# EAGLE schematic hoektronics-cnc-controller (EAGLE 5.12)

## Sheet 1 of 9
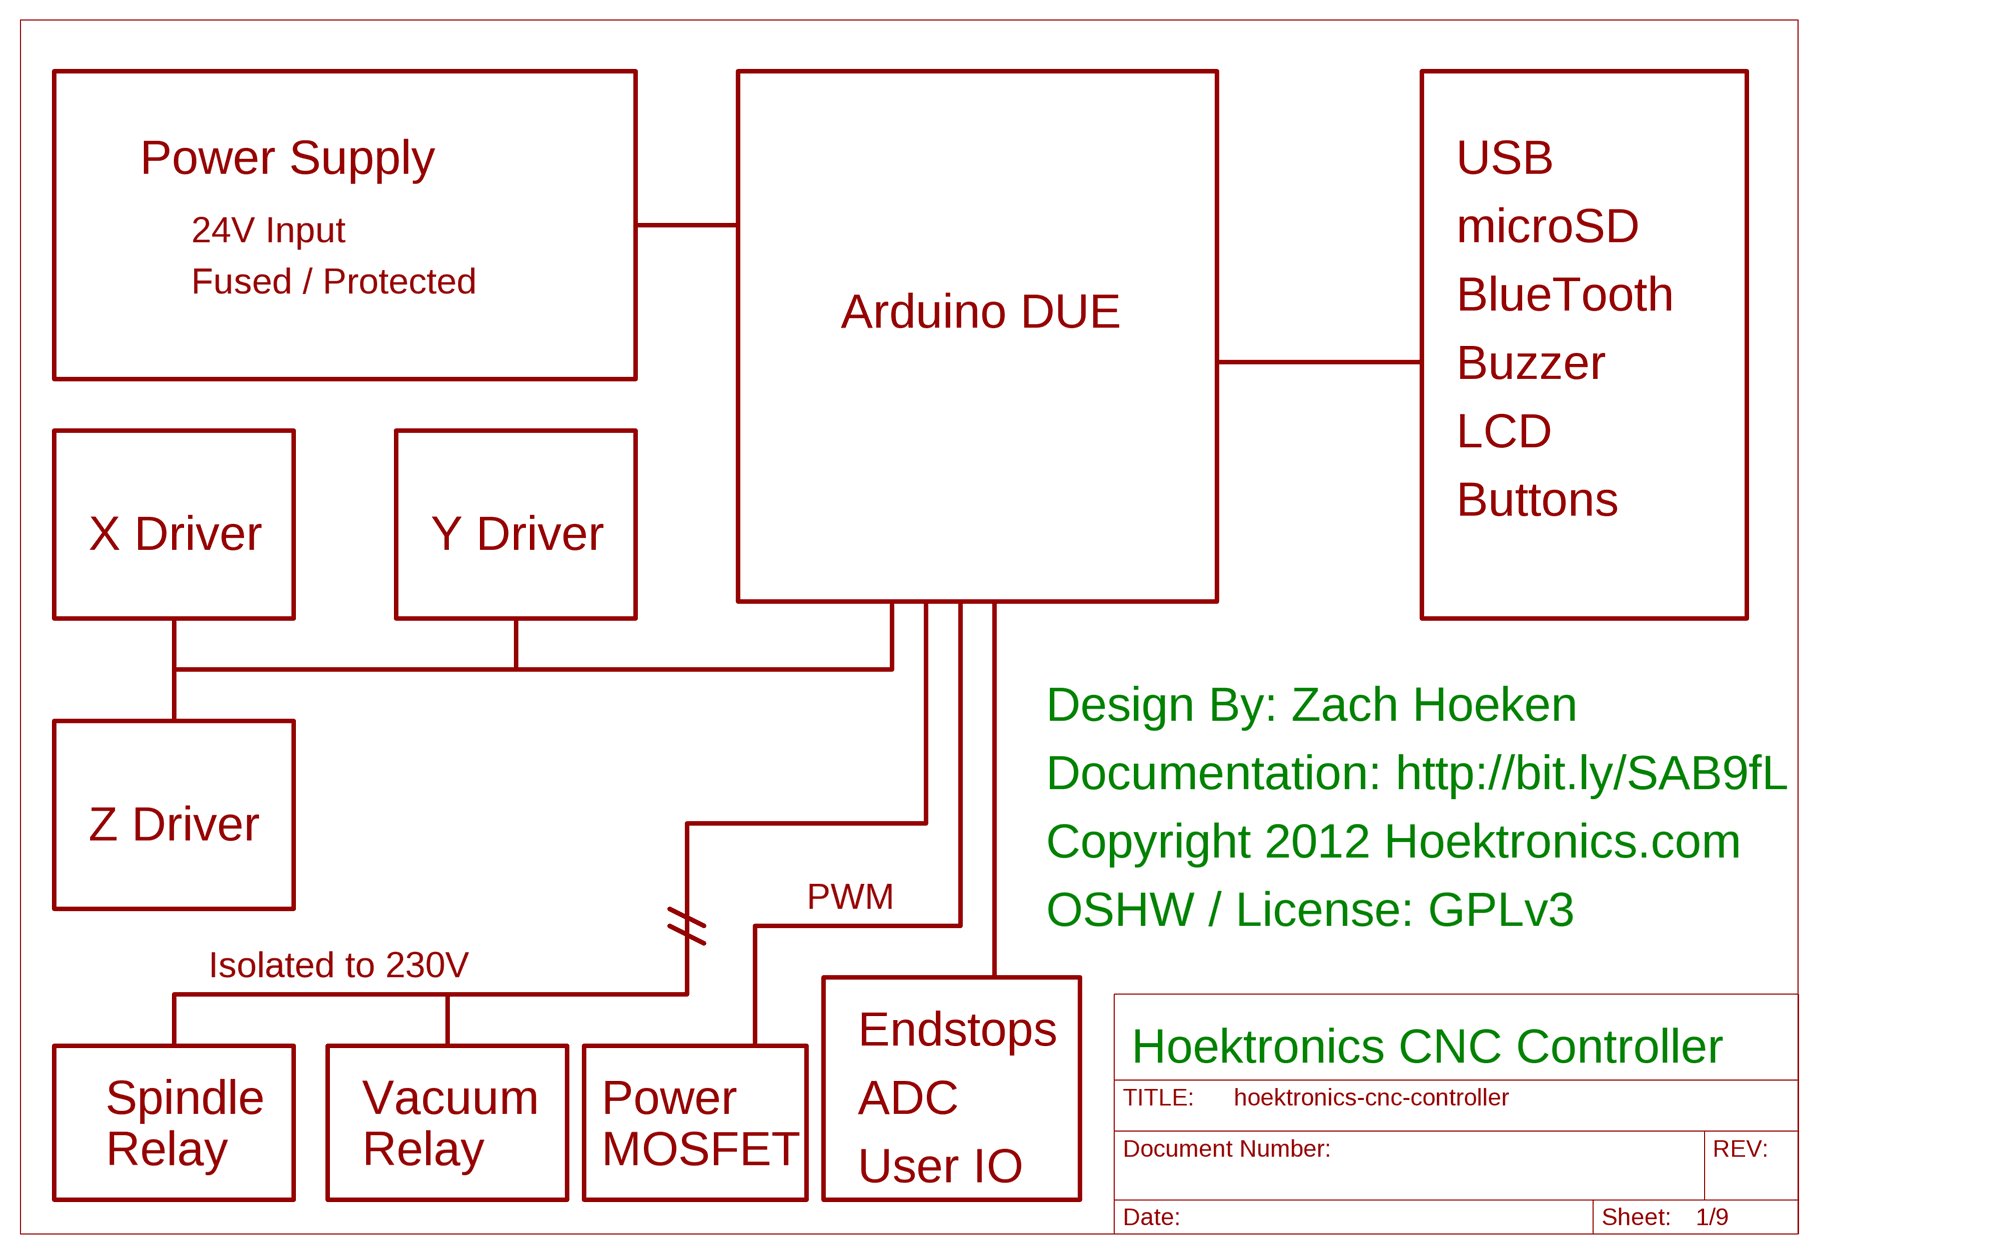
[diagram p0: schematic, sheet 1]

### Notes on the sheet
- Power Supply | USB
- 24V Input | microSD
- Fused / Protected
- BlueTooth
- Arduino DUE
- Buzzer
- LCD
- Buttons
- X Driver | Y Driver
- Design By: Zach Hoeken
- Documentation: http://bit.ly/SAB9fL
- Z Driver
- Copyright 2012 Hoektronics.com
- PWM
- OSHW / License: GPLv3
- Isolated to 230V
- Endstops
- Hoektronics CNC Controller
- Spindle | Vacuum | Power | ADC
- Relay | Relay | MOSFET
- User IO

## Sheet 2 of 9
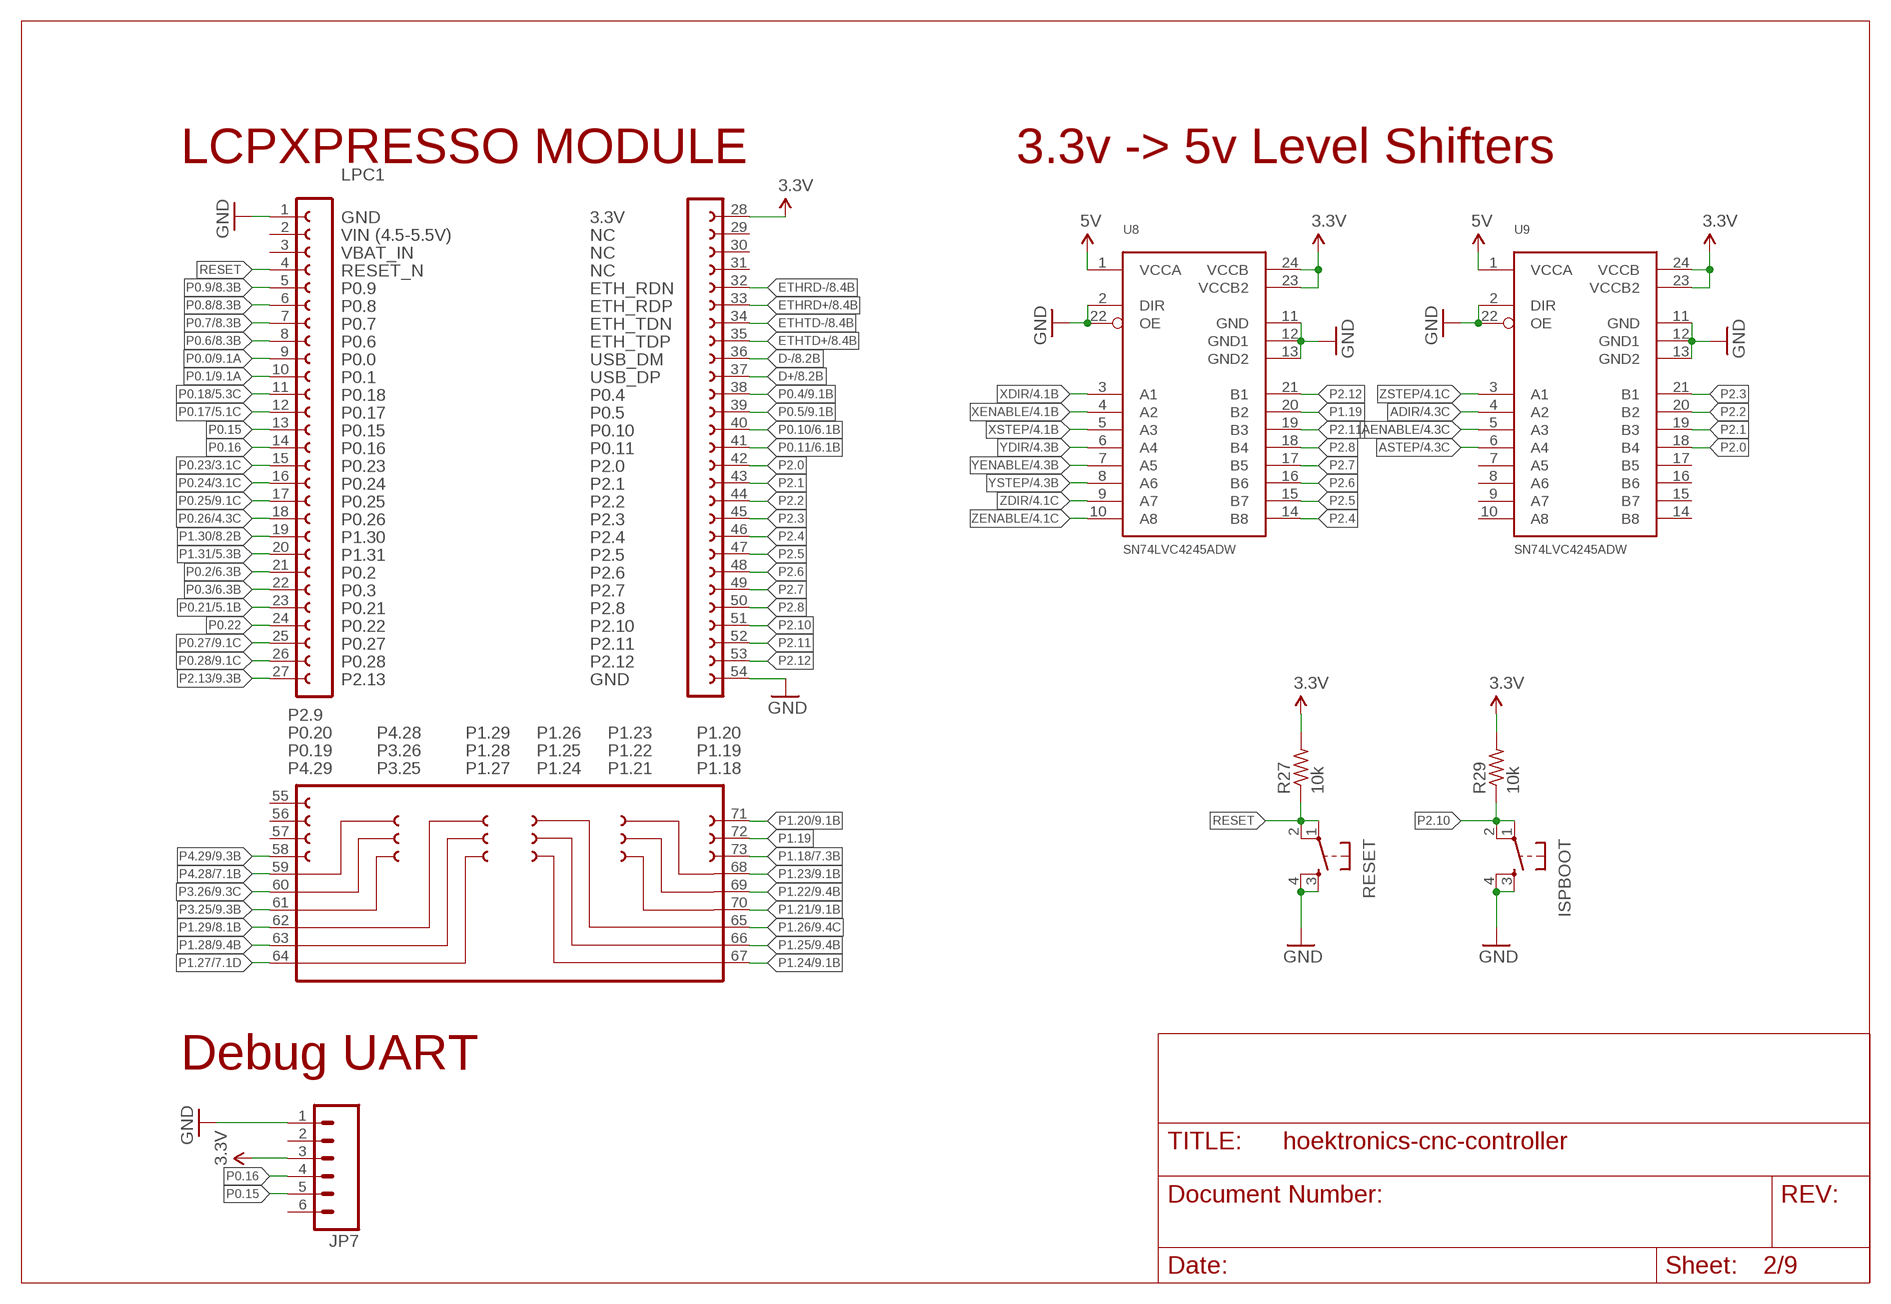
[diagram p1: schematic, sheet 2]

### Parts
ISPBOOT  TAC_SWITCHPTH  [TACTILE-PTH]
JP7  M06SIP  [1X06]
LPC1  LPCXPRESSO_LPC1769  [LPCXPRESSO_LPC1769]
R27  10k  R-US_R0805  [R0805]
R29  10k  R-US_R0805  [R0805]
RESET  TAC_SWITCHPTH  [TACTILE-PTH]
U8  SN74LVC4245ADW  [SO24W]
U9  SN74LVC4245ADW  [SO24W]

### Nets
3.3V: JP7.3 LPC1.28 R27.2 R29.2 U8.23(VCCB2) U8.24(VCCB) U9.23(VCCB2) U9.24(VCCB) ; also sheet 3,6,8,9
5V: U8.1(VCCA) U9.1(VCCA) ; also sheet 3,4,5,8
ADIR [signals]: U9.4(A2) ; also sheet 4,5
AENABLE [signals]: U9.5(A3) ; also sheet 4,5
ASTEP [signals]: U9.6(A4) ; also sheet 4,5
D+ [signals]: LPC1.37 ; also sheet 8
D- [signals]: LPC1.36 ; also sheet 8
ETHRD+ [signals]: LPC1.33 ; also sheet 8
ETHRD- [signals]: LPC1.32 ; also sheet 8
ETHTD+ [signals]: LPC1.35 ; also sheet 8
ETHTD- [signals]: LPC1.34 ; also sheet 8
GND: ISPBOOT.3 ISPBOOT.4 JP7.1 LPC1.1 LPC1.54 RESET.3 RESET.4 U8.2(DIR) U8.11(GND) U8.12(GND1) U8.13(GND2) U8.22(OE) U9.2(DIR) U9.11(GND) U9.12(GND1) U9.13(GND2) U9.22(OE) ; also sheet 3,4,5,6,7,8,9
P0.0 [signals]: LPC1.9 ; also sheet 9
P0.1 [signals]: LPC1.10 ; also sheet 9
P0.2 [signals]: LPC1.21 ; also sheet 6
P0.3 [signals]: LPC1.22 ; also sheet 6
P0.4 [signals]: LPC1.38 ; also sheet 9
P0.5 [signals]: LPC1.39 ; also sheet 9
P0.6 [signals]: LPC1.8 ; also sheet 8
P0.7 [signals]: LPC1.7 ; also sheet 8
P0.8 [signals]: LPC1.6 ; also sheet 8
P0.9 [signals]: LPC1.5 ; also sheet 8
P0.10 [signals]: LPC1.40 ; also sheet 6
P0.11 [signals]: LPC1.41 ; also sheet 6
P0.15: JP7.5 LPC1.13
P0.16: JP7.4 LPC1.14
P0.17 [signals]: LPC1.12 ; also sheet 5
P0.18 [signals]: LPC1.11 ; also sheet 5
P0.21 [signals]: LPC1.23 ; also sheet 5
P0.22 [signals]: LPC1.24
P0.23 [signals]: LPC1.15 ; also sheet 3
P0.24 [signals]: LPC1.16 ; also sheet 3
P0.25 [signals]: LPC1.17 ; also sheet 9
P0.26 [signals]: LPC1.18 ; also sheet 4
P0.27 [signals]: LPC1.25 ; also sheet 9
P0.28 [signals]: LPC1.26 ; also sheet 9
P1.18: LPC1.73 ; also sheet 7
P1.19: LPC1.72 U8.20(B2)
P1.20 [signals]: LPC1.71 ; also sheet 9
P1.21: LPC1.70 ; also sheet 9
P1.22: LPC1.69 ; also sheet 9
P1.23 [signals]: LPC1.68 ; also sheet 9
P1.24 [signals]: LPC1.67 ; also sheet 9
P1.25 [signals]: LPC1.66 ; also sheet 9
P1.26 [signals]: LPC1.65 ; also sheet 9
P1.27 [signals]: LPC1.64 ; also sheet 7
P1.28 [signals]: LPC1.63 ; also sheet 9
P1.29 [signals]: LPC1.62 ; also sheet 8
P1.30 [signals]: LPC1.19 ; also sheet 8
P1.31 [signals]: LPC1.20 ; also sheet 5
P2.0 [signals]: LPC1.42 U9.18(B4)
P2.1 [signals]: LPC1.43 U9.19(B3)
P2.2 [signals]: LPC1.44 U9.20(B2)
P2.3 [signals]: LPC1.45 U9.21(B1)
P2.4 [signals]: LPC1.46 U8.14(B8)
P2.5 [signals]: LPC1.47 U8.15(B7)
P2.6 [signals]: LPC1.48 U8.16(B6)
P2.7 [signals]: LPC1.49 U8.17(B5)
P2.8 [signals]: LPC1.50 U8.18(B4)
P2.10 [signals]: ISPBOOT.1 ISPBOOT.2 LPC1.51 R29.1
P2.11 [signals]: LPC1.52 U8.19(B3)
P2.12 [signals]: LPC1.53 U8.21(B1)
P2.13 [signals]: LPC1.27 ; also sheet 9
P3.25 [signals]: LPC1.61 ; also sheet 9
P3.26 [signals]: LPC1.60 ; also sheet 9
P4.28 [signals]: LPC1.59 ; also sheet 7
P4.29 [signals]: LPC1.58 ; also sheet 9
RESET: LPC1.4 R27.1 RESET.1 RESET.2
XDIR [signals]: U8.3(A1) ; also sheet 4,5
XENABLE [signals]: U8.4(A2) ; also sheet 4,5
XSTEP [signals]: U8.5(A3) ; also sheet 4,5
YDIR [signals]: U8.6(A4) ; also sheet 4,5
YENABLE [signals]: U8.7(A5) ; also sheet 4,5
YSTEP [signals]: U8.8(A6) ; also sheet 4,5
ZDIR [signals]: U8.9(A7) ; also sheet 4,5
ZENABLE [signals]: U8.10(A8) ; also sheet 4,5
ZSTEP [signals]: U9.3(A1) ; also sheet 4,5
Unconnected: JP7.2 JP7.6 LPC1.2 LPC1.3 LPC1.29 LPC1.30 LPC1.31 LPC1.55 LPC1.56 LPC1.57 U9.7(A5) U9.8(A6) U9.9(A7) U9.10(A8) U9.14(B8) U9.15(B7) U9.16(B6) U9.17(B5)

### Notes on the sheet
- LCPXPRESSO MODULE | 3.3v -> 5v Level Shifters
- Debug UART

## Sheet 3 of 9
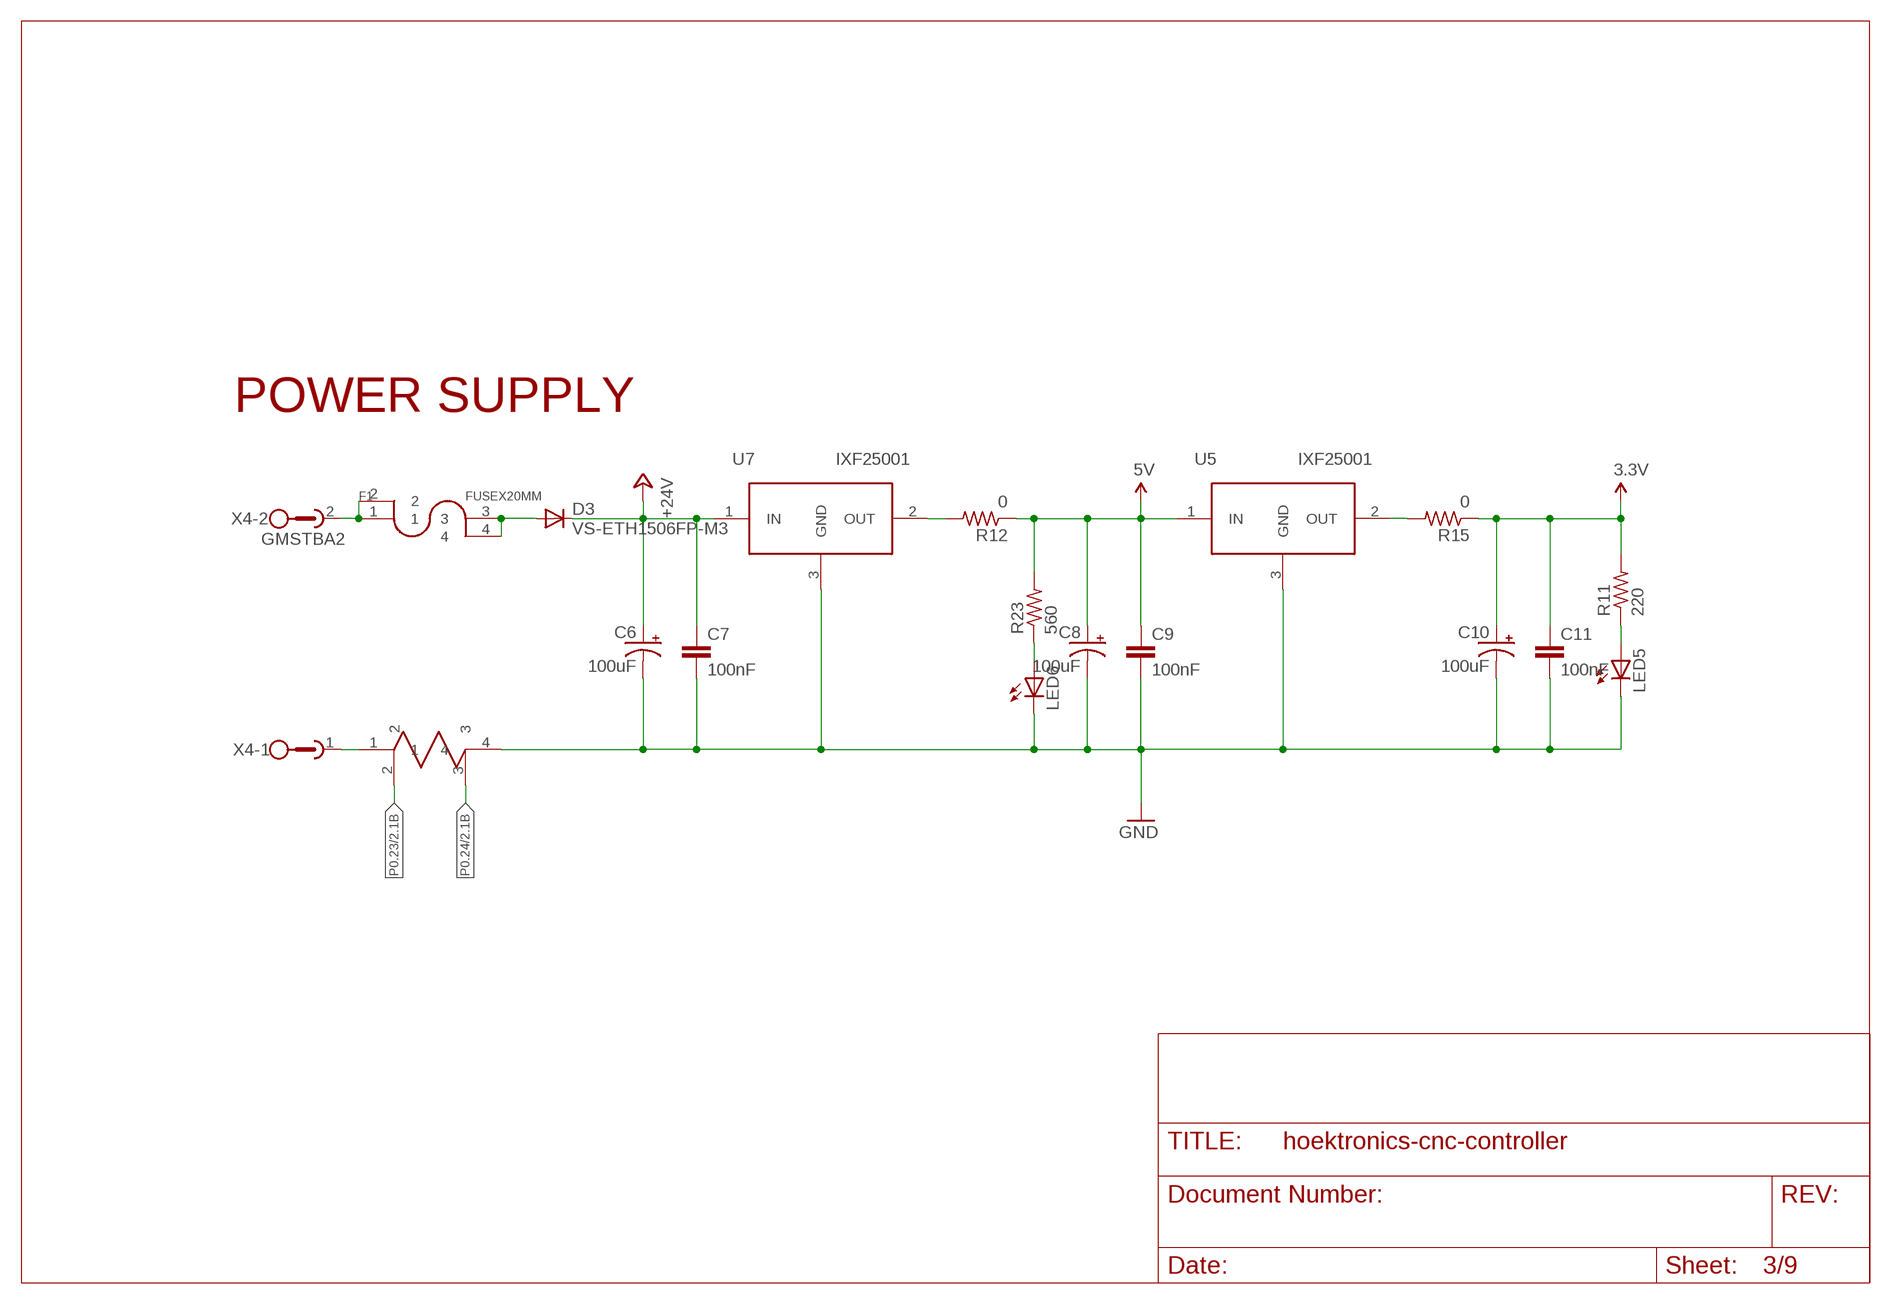
[diagram p2: schematic, sheet 3]

### Parts
C6  100uF  CPOL-USE2.5-7  [E2,5-7]
C7  100nF  CAP0805  [0805]
C8  100uF  CPOL-USE2.5-7  [E2,5-7]
C9  100nF  CAP0805  [0805]
C10  100uF  CPOL-USE2.5-7  [E2,5-7]
C11  100nF  CAP0805  [0805]
D3  VS-ETH1506FP-M3  BYT85  [DO220S]
F1  FUSEX20MM  [FUSE_5MM]
LED5  LED1206  [LED-1206]
LED6  LED1206  [LED-1206]
R11  220  R-US_R0805  [R0805]
R12  0  R-US_R0805  [R0805]
R15  0  R-US_R0805  [R0805]
R23  560  R-US_R0805  [R0805]
R28  WSL3637  [WSL3637]
U5  IXF25001  [TO252]
U7  IXF25001  [TO252]
X4  GMSTBA2  [GMSTBA2]

### Nets
3.3V: C10.+ C11.1 R11.2 R15.1 ; also sheet 2,6,8,9
5V: C8.+ C9.1 R12.1 R23.2 U5.1(IN) ; also sheet 2,4,5,8
+24V [power]: C6.+ C7.1 D3.C U7.1(IN) ; also sheet 4,5,7
GND: C6.- C7.2 C8.- C9.2 C10.- C11.2 LED5.C LED6.C R28.4 U5.3(GND) U7.3(GND) ; also sheet 2,4,5,6,7,8,9
N$6: R12.2 U7.2(OUT)
N$27: R15.2 U5.2(OUT)
N$28 [power]: D3.A F1.3 F1.4
N$39: LED6.A R23.1
N$40: LED5.A R11.1
P0.23 [signals]: R28.2 ; also sheet 2
P0.24 [signals]: R28.3 ; also sheet 2
PRE24: F1.1 F1.2 X4.2
PREGND: R28.1 X4.1

### Notes on the sheet
- POWER SUPPLY

## Sheet 4 of 9
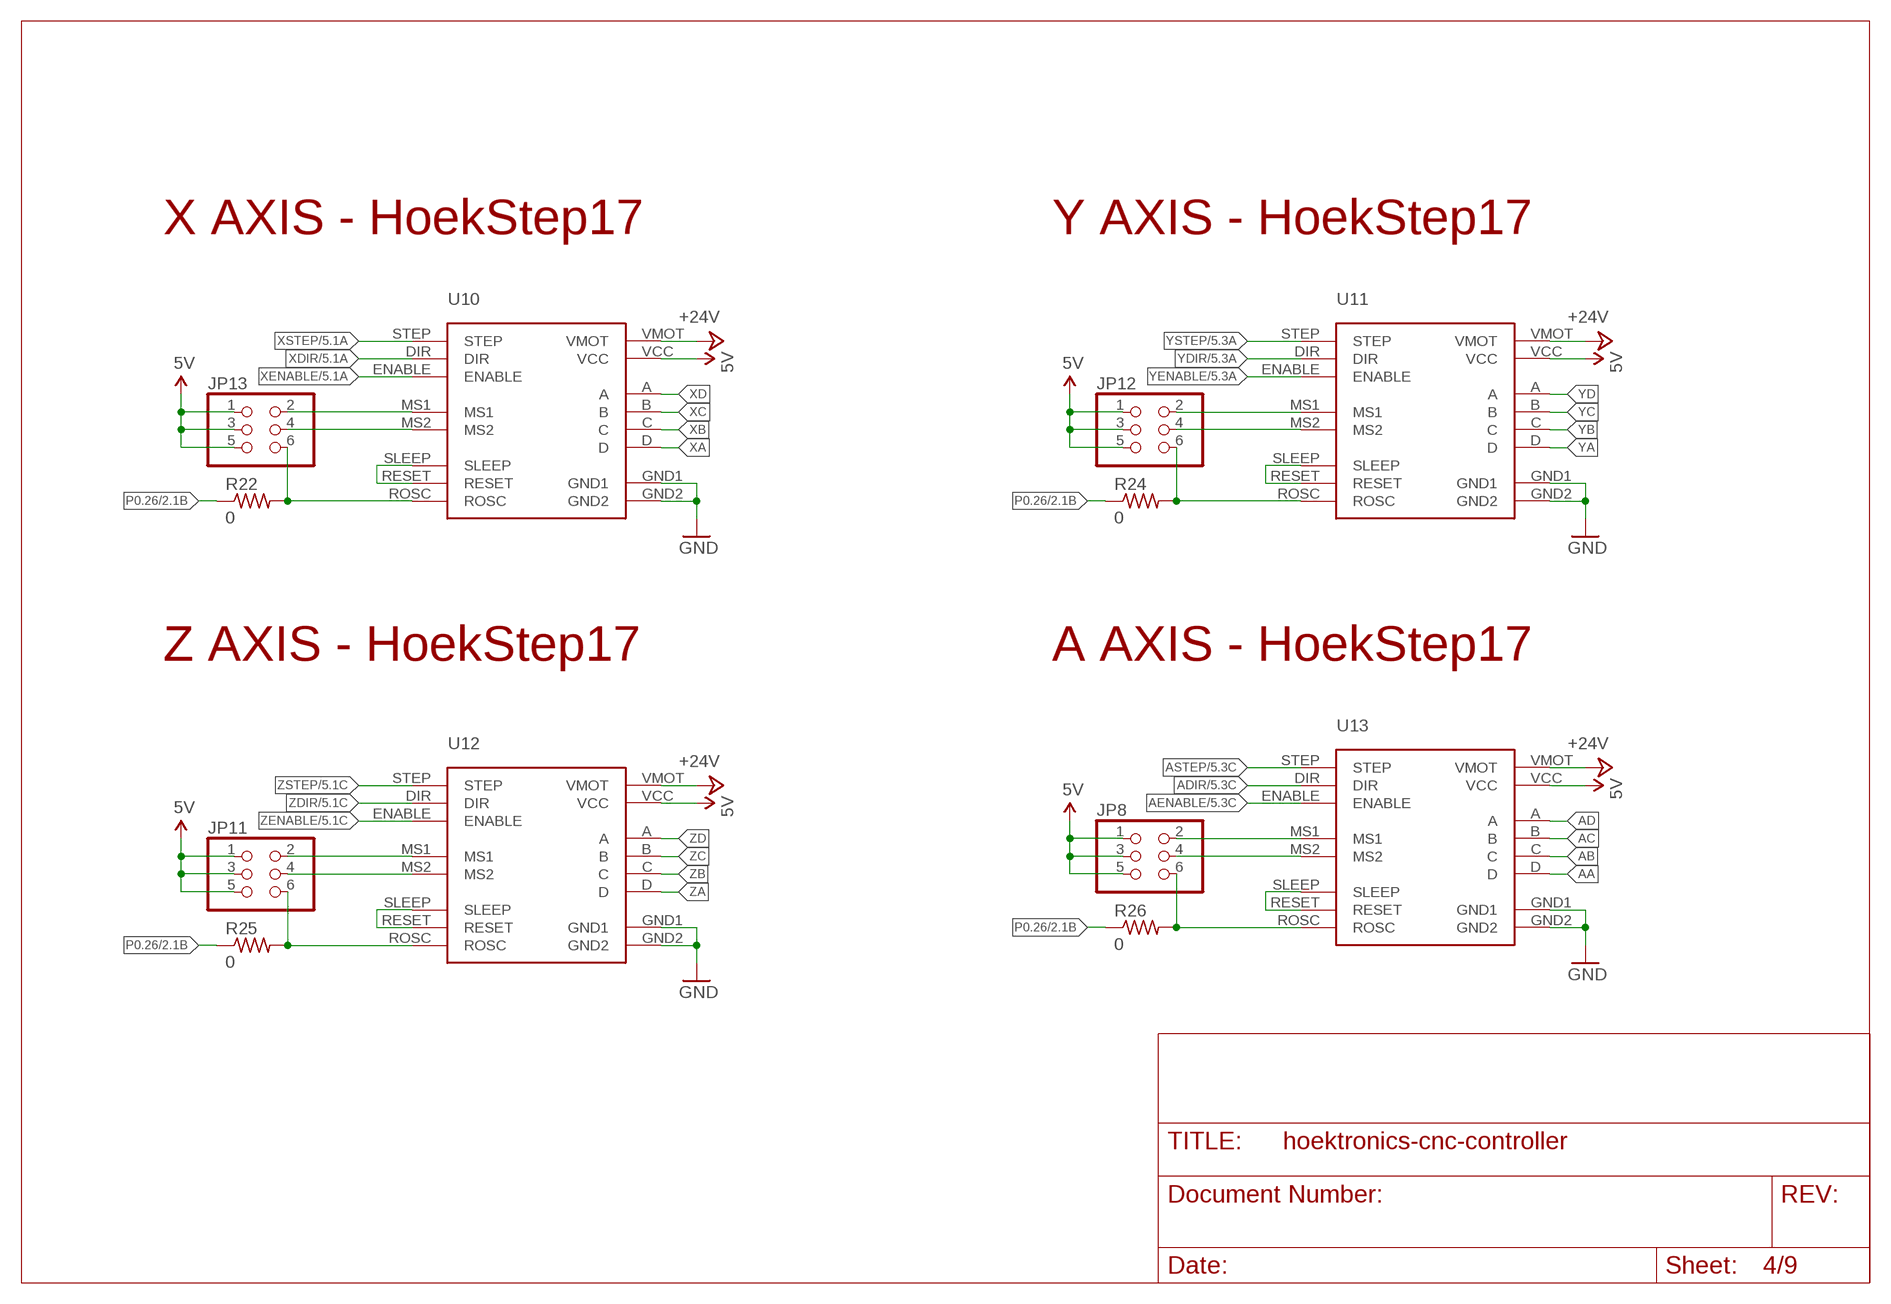
[diagram p3: schematic, sheet 4]

### Parts
JP8  PINHD-2X3  [2X03]
JP11  PINHD-2X3  [2X03]
JP12  PINHD-2X3  [2X03]
JP13  PINHD-2X3  [2X03]
R22  0  R-US_R0805  [R0805]
R24  0  R-US_R0805  [R0805]
R25  0  R-US_R0805  [R0805]
R26  0  R-US_R0805  [R0805]
U10  HOEKSTEP17  [HOEKSTEP17]
U11  HOEKSTEP17  [HOEKSTEP17]
U12  HOEKSTEP17  [HOEKSTEP17]
U13  HOEKSTEP17  [HOEKSTEP17]

### Nets
5V: JP8.1 JP8.3 JP8.5 JP11.1 JP11.3 JP11.5 JP12.1 JP12.3 JP12.5 JP13.1 JP13.3 JP13.5 U10.VCC U11.VCC U12.VCC U13.VCC ; also sheet 2,3,5,8
+24V [power]: U10.VMOT U11.VMOT U12.VMOT U13.VMOT ; also sheet 3,5,7
AA [power]: U13.D ; also sheet 5
AB [power]: U13.C ; also sheet 5
AC [power]: U13.B ; also sheet 5
AD [power]: U13.A ; also sheet 5
ADIR [signals]: U13.DIR ; also sheet 2,5
AENABLE [signals]: U13.ENABLE ; also sheet 2,5
ASTEP [signals]: U13.STEP ; also sheet 2,5
GND: U10.GND1 U10.GND2 U11.GND1 U11.GND2 U12.GND1 U12.GND2 U13.GND1 U13.GND2 ; also sheet 2,3,5,6,7,8,9
N$1: U10.RESET U10.SLEEP
N$2: U11.RESET U11.SLEEP
N$3: U12.RESET U12.SLEEP
N$4: U13.RESET U13.SLEEP
N$7: JP13.2 U10.MS1
N$9: JP13.4 U10.MS2
N$10: JP13.6 R22.2 U10.ROSC
N$11: JP12.2 U11.MS1
N$12: JP12.4 U11.MS2
N$13: JP12.6 R24.2 U11.ROSC
N$14: JP11.2 U12.MS1
N$21: JP11.4 U12.MS2
N$22: JP11.6 R25.2 U12.ROSC
N$23: JP8.2 U13.MS1
N$24: JP8.4 U13.MS2
N$31: JP8.6 R26.2 U13.ROSC
P0.26 [signals]: R22.1 R24.1 R25.1 R26.1 ; also sheet 2
XA [power]: U10.D ; also sheet 5
XB [power]: U10.C ; also sheet 5
XC [power]: U10.B ; also sheet 5
XD [power]: U10.A ; also sheet 5
XDIR [signals]: U10.DIR ; also sheet 2,5
XENABLE [signals]: U10.ENABLE ; also sheet 2,5
XSTEP [signals]: U10.STEP ; also sheet 2,5
YA [power]: U11.D ; also sheet 5
YB [power]: U11.C ; also sheet 5
YC [power]: U11.B ; also sheet 5
YD [power]: U11.A ; also sheet 5
YDIR [signals]: U11.DIR ; also sheet 2,5
YENABLE [signals]: U11.ENABLE ; also sheet 2,5
YSTEP [signals]: U11.STEP ; also sheet 2,5
ZA [power]: U12.D ; also sheet 5
ZB [power]: U12.C ; also sheet 5
ZC [power]: U12.B ; also sheet 5
ZD [power]: U12.A ; also sheet 5
ZDIR [signals]: U12.DIR ; also sheet 2,5
ZENABLE [signals]: U12.ENABLE ; also sheet 2,5
ZSTEP [signals]: U12.STEP ; also sheet 2,5

### Notes on the sheet
- X AXIS - HoekStep17 | Y AXIS - HoekStep17
- Z AXIS - HoekStep17 | A AXIS - HoekStep17

## Sheet 5 of 9
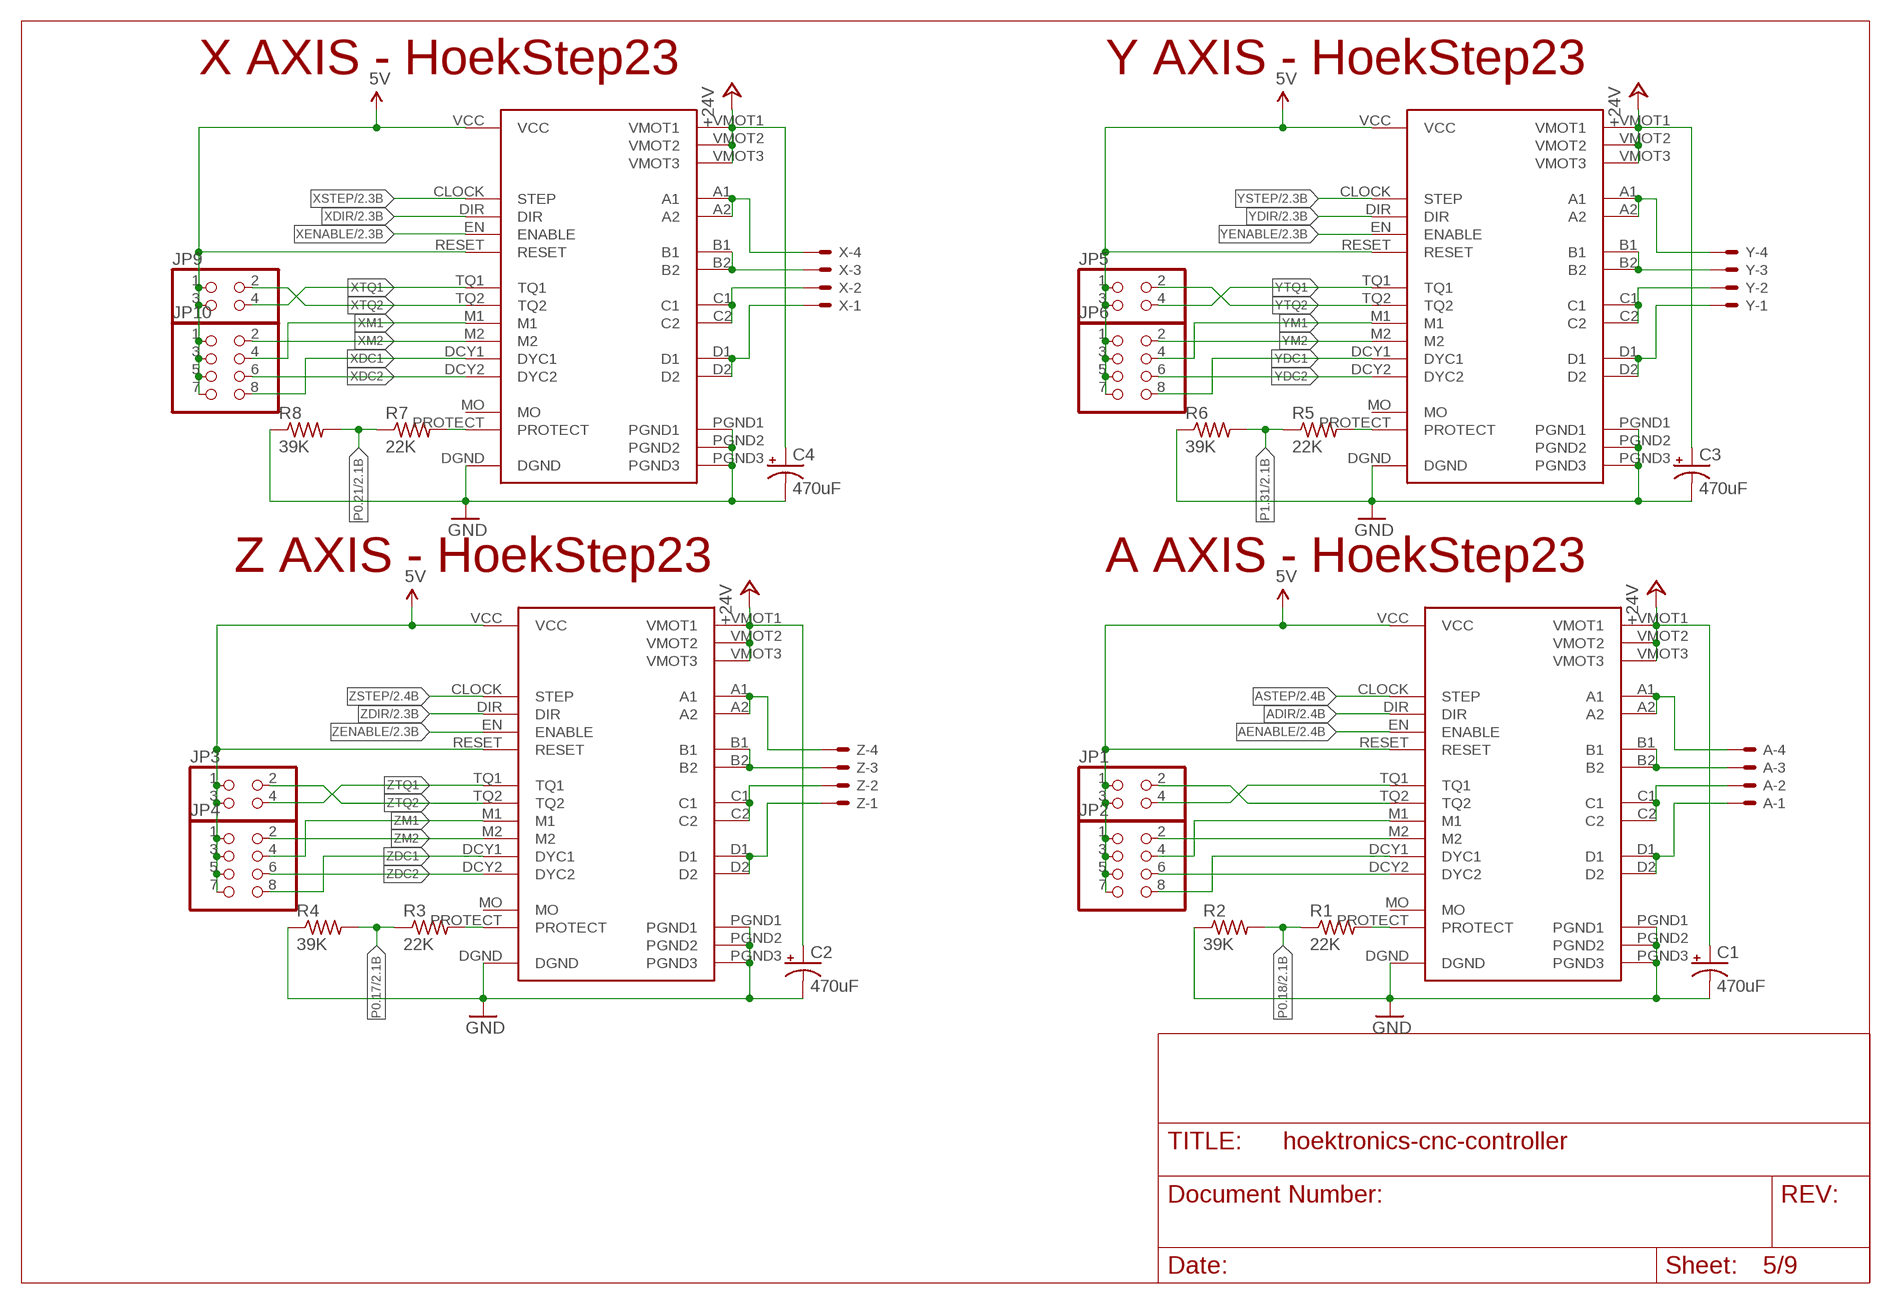
[diagram p4: schematic, sheet 5]

### Parts
A  KK-156-4  [KK-156-4]
C1  470uF  CPOL-USE3.5-8  [E3,5-8]
C2  470uF  CPOL-USE3.5-8  [E3,5-8]
C3  470uF  CPOL-USE3.5-8  [E3,5-8]
C4  470uF  CPOL-USE3.5-8  [E3,5-8]
JP1  PINHD-2X2  [2X02]
JP2  PINHD-2X4  [2X04]
JP3  PINHD-2X2  [2X02]
JP4  PINHD-2X4  [2X04]
JP5  PINHD-2X2  [2X02]
JP6  PINHD-2X4  [2X04]
JP9  PINHD-2X2  [2X02]
JP10  PINHD-2X4  [2X04]
R1  22K  R-US_R0805  [R0805]
R2  39K  R-US_R0805  [R0805]
R3  22K  R-US_R0805  [R0805]
R4  39K  R-US_R0805  [R0805]
R5  22K  R-US_R0805  [R0805]
R6  39K  R-US_R0805  [R0805]
R7  22K  R-US_R0805  [R0805]
R8  39K  R-US_R0805  [R0805]
U1  HOEKSTEP23  [HOEKSTEP23]
U2  HOEKSTEP23  [HOEKSTEP23]
U3  HOEKSTEP23  [HOEKSTEP23]
U4  HOEKSTEP23  [HOEKSTEP23]
X  KK-156-4  [KK-156-4]
Y  KK-156-4  [KK-156-4]
Z  KK-156-4  [KK-156-4]

### Nets
5V: JP1.1 JP1.3 JP2.1 JP2.3 JP2.5 JP2.7 JP3.1 JP3.3 JP4.1 JP4.3 JP4.5 JP4.7 JP5.1 JP5.3 JP6.1 JP6.3 JP6.5 JP6.7 JP9.1 JP9.3 JP10.1 JP10.3 JP10.5 JP10.7 U1.RESET U1.VCC U2.RESET U2.VCC U3.RESET U3.VCC U4.RESET U4.VCC ; also sheet 2,3,4,8
+24V [power]: C1.+ C2.+ C3.+ C4.+ U1.VMOT1 U1.VMOT2 U1.VMOT3 U2.VMOT1 U2.VMOT2 U2.VMOT3 U3.VMOT1 U3.VMOT2 U3.VMOT3 U4.VMOT1 U4.VMOT2 U4.VMOT3 ; also sheet 3,4,7
AA [power]: A.4 U4.A1 U4.A2 ; also sheet 4
AB [power]: A.3 U4.B1 U4.B2 ; also sheet 4
AC [power]: A.2 U4.C1 U4.C2 ; also sheet 4
AD [power]: A.1 U4.D1 U4.D2 ; also sheet 4
ADC1 [signals]: JP2.8 U4.DCY1(DYC1)
ADC2 [signals]: JP2.6 U4.DCY2(DYC2)
ADIR [signals]: U4.DIR ; also sheet 2,4
AENABLE [signals]: U4.EN(ENABLE) ; also sheet 2,4
AM1 [signals]: JP2.4 U4.M1
AM2 [signals]: JP2.2 U4.M2
ASTEP [signals]: U4.CLOCK(STEP) ; also sheet 2,4
ATQ1 [signals]: JP1.4 U4.TQ1
ATQ2 [signals]: JP1.2 U4.TQ2
GND: C1.- C2.- C3.- C4.- R2.1 R4.1 R6.1 R8.1 U1.DGND U1.PGND1 U1.PGND2 U1.PGND3 U2.DGND U2.PGND1 U2.PGND2 U2.PGND3 U3.DGND U3.PGND1 U3.PGND2 U3.PGND3 U4.DGND U4.PGND1 U4.PGND2 U4.PGND3 ; also sheet 2,3,4,6,7,8,9
N$8: R3.2 U3.PROTECT
N$16: R1.2 U4.PROTECT
N$43: R7.2 U1.PROTECT
N$44: R5.2 U2.PROTECT
P0.17 [signals]: R3.1 R4.2 ; also sheet 2
P0.18 [signals]: R1.1 R2.2 ; also sheet 2
P0.21 [signals]: R7.1 R8.2 ; also sheet 2
P1.31 [signals]: R5.1 R6.2 ; also sheet 2
XA [power]: U1.A1 U1.A2 X.4 ; also sheet 4
XB [power]: U1.B1 U1.B2 X.3 ; also sheet 4
XC [power]: U1.C1 U1.C2 X.2 ; also sheet 4
XD [power]: U1.D1 U1.D2 X.1 ; also sheet 4
XDC1 [signals]: JP10.8 U1.DCY1(DYC1)
XDC2 [signals]: JP10.6 U1.DCY2(DYC2)
XDIR [signals]: U1.DIR ; also sheet 2,4
XENABLE [signals]: U1.EN(ENABLE) ; also sheet 2,4
XM1 [signals]: JP10.4 U1.M1
XM2 [signals]: JP10.2 U1.M2
XSTEP [signals]: U1.CLOCK(STEP) ; also sheet 2,4
XTQ1 [signals]: JP9.4 U1.TQ1
XTQ2 [signals]: JP9.2 U1.TQ2
YA [power]: U2.A1 U2.A2 Y.4 ; also sheet 4
YB [power]: U2.B1 U2.B2 Y.3 ; also sheet 4
YC [power]: U2.C1 U2.C2 Y.2 ; also sheet 4
YD [power]: U2.D1 U2.D2 Y.1 ; also sheet 4
YDC1 [signals]: JP6.8 U2.DCY1(DYC1)
YDC2 [signals]: JP6.6 U2.DCY2(DYC2)
YDIR [signals]: U2.DIR ; also sheet 2,4
YENABLE [signals]: U2.EN(ENABLE) ; also sheet 2,4
YM1 [signals]: JP6.4 U2.M1
YM2 [signals]: JP6.2 U2.M2
YSTEP [signals]: U2.CLOCK(STEP) ; also sheet 2,4
YTQ1 [signals]: JP5.4 U2.TQ1
YTQ2 [signals]: JP5.2 U2.TQ2
ZA [power]: U3.A1 U3.A2 Z.4 ; also sheet 4
ZB [power]: U3.B1 U3.B2 Z.3 ; also sheet 4
ZC [power]: U3.C1 U3.C2 Z.2 ; also sheet 4
ZD [power]: U3.D1 U3.D2 Z.1 ; also sheet 4
ZDC1 [signals]: JP4.8 U3.DCY1(DYC1)
ZDC2 [signals]: JP4.6 U3.DCY2(DYC2)
ZDIR [signals]: U3.DIR ; also sheet 2,4
ZENABLE [signals]: U3.EN(ENABLE) ; also sheet 2,4
ZM1 [signals]: JP4.4 U3.M1
ZM2 [signals]: JP4.2 U3.M2
ZSTEP [signals]: U3.CLOCK(STEP) ; also sheet 2,4
ZTQ1 [signals]: JP3.4 U3.TQ1
ZTQ2 [signals]: JP3.2 U3.TQ2
Unconnected: U1.MO U2.MO U3.MO U4.MO

### Notes on the sheet
- X AXIS - HoekStep23 | Y AXIS - HoekStep23
- Z AXIS - HoekStep23 | A AXIS - HoekStep23

## Sheet 6 of 9
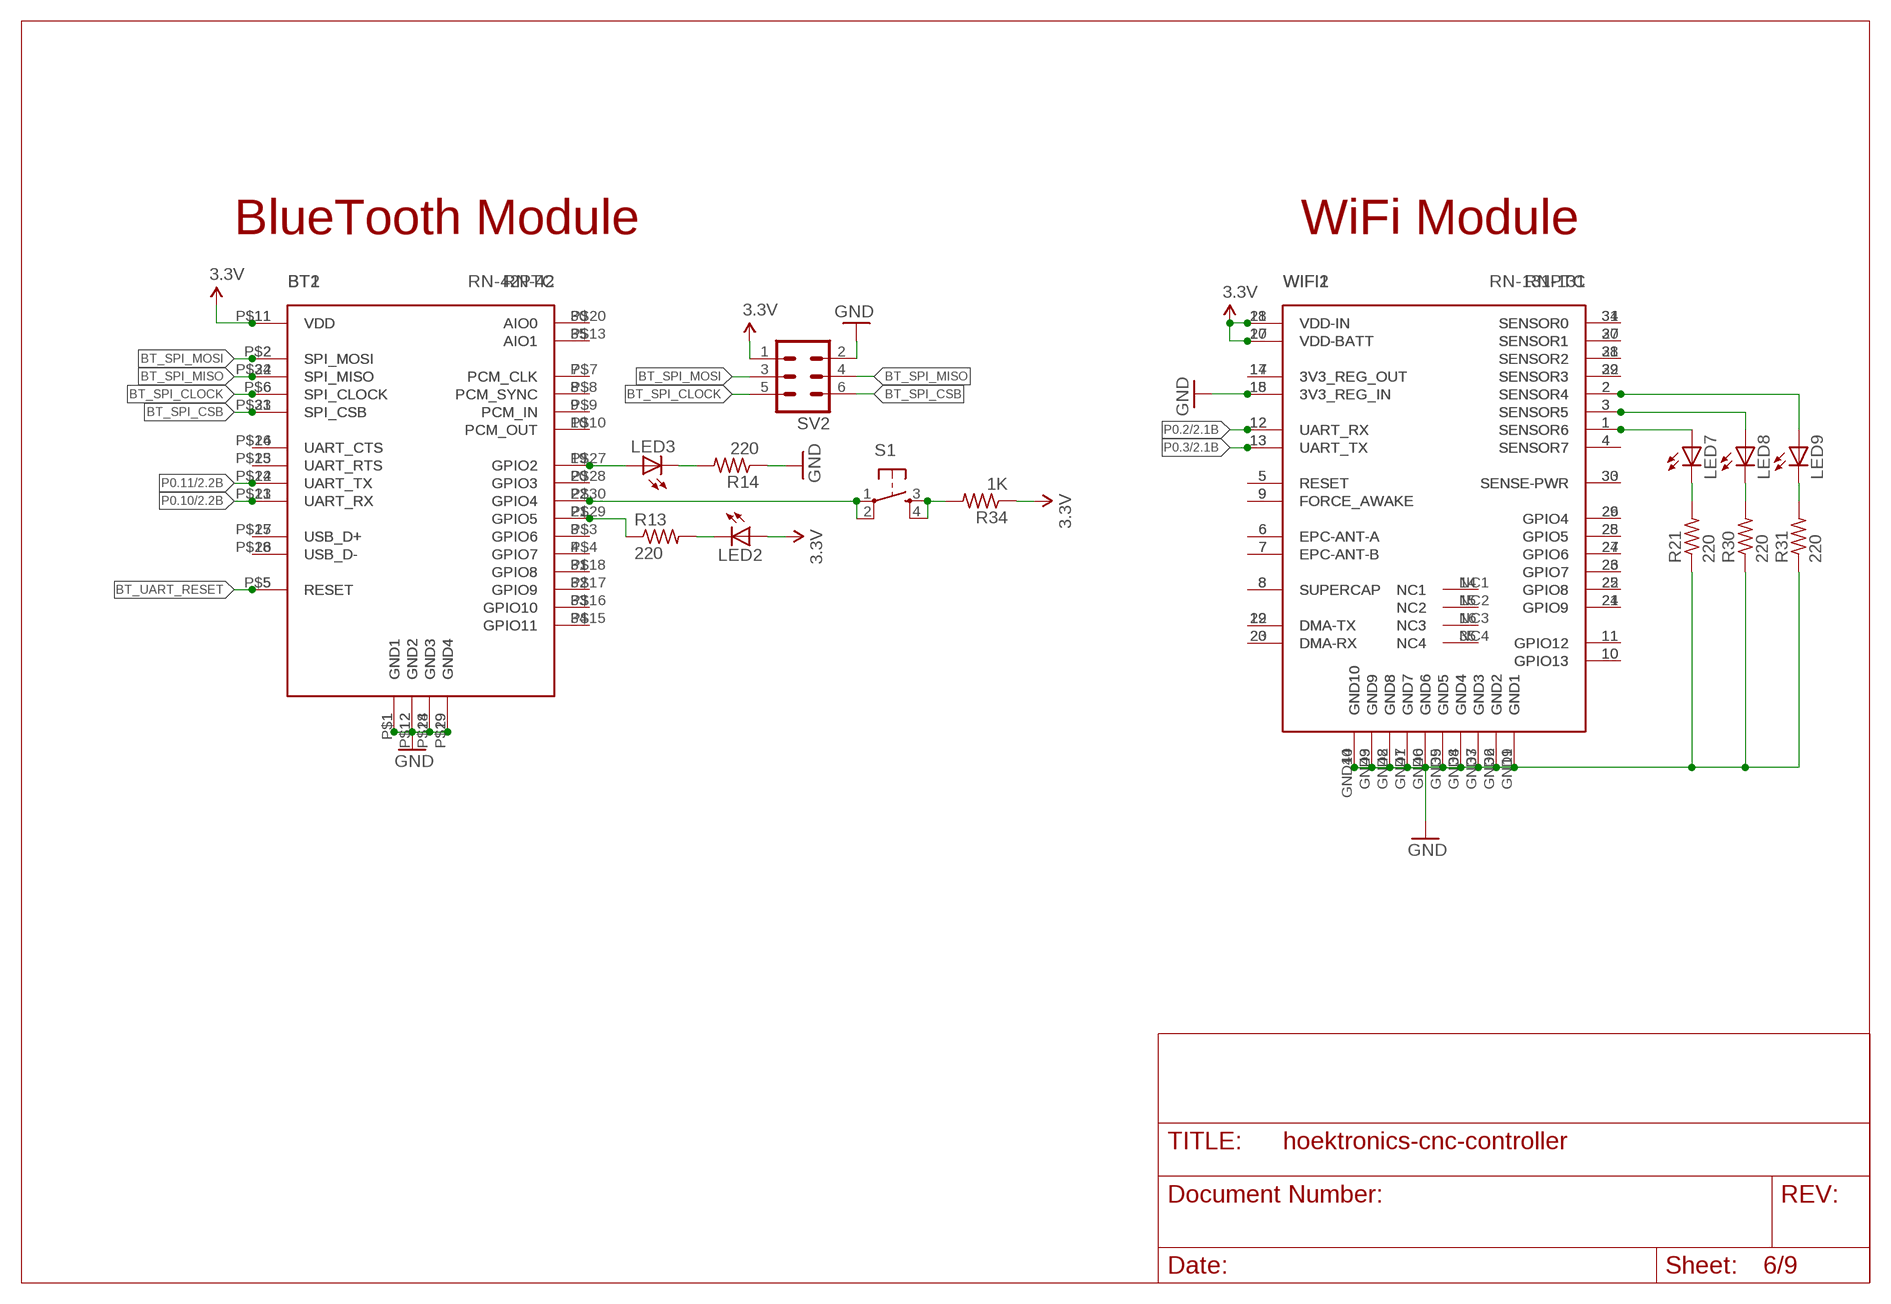
[diagram p5: schematic, sheet 6]

### Parts
BT1  RN-42  RN-42SMT  [RN-42]
BT2  RN-42PTC  [RN-42-CARRIER]
LED2  LED1206  [LED-1206]
LED3  LED1206  [LED-1206]
LED7  LED1206  [LED-1206]
LED8  LED1206  [LED-1206]
LED9  LED1206  [LED-1206]
R13  220  R-US_R0805  [R0805]
R14  220  R-US_R0805  [R0805]
R21  220  R-US_R0805  [R0805]
R30  220  R-US_R0805  [R0805]
R31  220  R-US_R0805  [R0805]
R34  1K  R-US_R0805  [R0805]
S1  TAC_SWITCHPTH  [TACTILE-PTH]
SV2  ML6  [ML6]
WIFI1  RN-131  RN-131SMT  [RN-131]
WIFI2  RN-131PTC  [RN-131-CARRIER]

### Nets
3.3V: BT1.11(VDD) BT2.P$11(VDD) LED2.A R34.1 SV2.1 WIFI1.20(VDD-BATT) WIFI1.21(VDD-IN) WIFI2.17(VDD-BATT) WIFI2.18(VDD-IN) ; also sheet 2,3,8,9
BT_SPI_CLOCK: BT1.6(SPI_CLOCK) BT2.P$6(SPI_CLOCK) SV2.5
BT_SPI_CSB: BT1.23(SPI_CSB) BT2.P$31(SPI_CSB) SV2.6
BT_SPI_MISO: BT1.24(SPI_MISO) BT2.P$32(SPI_MISO) SV2.4
BT_SPI_MOSI: BT1.2(SPI_MOSI) BT2.P$2(SPI_MOSI) SV2.3
BT_UART_RESET: BT1.5(RESET) BT2.P$5(RESET)
GND: BT1.1(GND1) BT1.12(GND2) BT1.28(GND3) BT1.29(GND4) BT2.P$1(GND1) BT2.P$12(GND2) BT2.P$14(GND3) BT2.P$19(GND4) R14.1 R21.1 R30.1 R31.1 SV2.2 WIFI1.18(3V3_REG_IN) WIFI1.19(GND1) WIFI1.36(GND2) WIFI1.37(GND3) WIFI1.38(GND4) WIFI1.39(GND5) WIFI1.40(GND6) WIFI1.41(GND7) WIFI1.42(GND8) WIFI1.43(GND9) WIFI1.44(GND10) WIFI2.15(3V3_REG_IN) WIFI2.GND1 WIFI2.GND2 WIFI2.GND3 WIFI2.GND4 WIFI2.GND5 WIFI2.GND6 WIFI2.GND7 WIFI2.GND8 WIFI2.GND9 WIFI2.GND10 ; also sheet 2,3,4,5,7,8,9
N$25: BT1.16(UART_CTS) BT2.P$24(UART_CTS)
N$26: BT1.15(UART_RTS) BT2.P$23(UART_RTS)
N$32: BT1.21(GPIO5) BT2.P$29(GPIO5) R13.1
N$33: LED2.C R13.2
N$34: BT1.19(GPIO2) BT2.P$27(GPIO2) LED3.A
N$36: LED3.C R14.2
N$41: BT1.22(GPIO4) BT2.P$30(GPIO4) S1.1 S1.2
N$42: R34.2 S1.3 S1.4
N$45: BT1.17(USB_D+) BT2.P$25(USB_D+)
N$46: BT1.18(USB_D-) BT2.P$26(USB_D-)
N$47: BT1.30(AIO0) BT2.P$20(AIO0)
N$48: BT1.35(AIO1) BT2.P$13(AIO1)
N$49: BT1.7(PCM_CLK) BT2.P$7(PCM_CLK)
N$50: BT1.8(PCM_SYNC) BT2.P$8(PCM_SYNC)
N$51: BT1.9(PCM_IN) BT2.P$9(PCM_IN)
N$52: BT1.10(PCM_OUT) BT2.P$10(PCM_OUT)
N$53: BT1.20(GPIO3) BT2.P$28(GPIO3)
N$54: BT1.3(GPIO6) BT2.P$3(GPIO6)
N$55: BT1.4(GPIO7) BT2.P$4(GPIO7)
N$56: BT1.31(GPIO8) BT2.P$18(GPIO8)
N$57: BT1.32(GPIO9) BT2.P$17(GPIO9)
N$58: BT1.33(GPIO10) BT2.P$16(GPIO10)
N$59: BT1.34(GPIO11) BT2.P$15(GPIO11)
N$60: WIFI1.34(SENSOR0) WIFI2.31(SENSOR0)
N$61: WIFI1.30(SENSOR1) WIFI2.27(SENSOR1)
N$62: WIFI1.31(SENSOR2) WIFI2.28(SENSOR2)
N$63: WIFI1.32(SENSOR3) WIFI2.29(SENSOR3)
N$64: LED9.A WIFI1.2(SENSOR4) WIFI2.2(SENSOR4)
N$65: LED8.A WIFI1.3(SENSOR5) WIFI2.3(SENSOR5)
N$66: LED7.A WIFI1.1(SENSOR6) WIFI2.1(SENSOR6)
N$67: WIFI1.4(SENSOR7) WIFI2.4(SENSOR7)
N$68: WIFI1.5(RESET) WIFI2.5(RESET)
N$69: WIFI1.6(EPC-ANT-A) WIFI2.6(EPC-ANT-A)
N$70: WIFI1.7(EPC-ANT-B) WIFI2.7(EPC-ANT-B)
N$71: WIFI1.8(SUPERCAP) WIFI2.8(SUPERCAP)
N$72: WIFI1.9(FORCE_AWAKE) WIFI2.9(FORCE_AWAKE)
N$73: WIFI1.10(GPIO13) WIFI2.10(GPIO13)
N$74: WIFI1.11(GPIO12) WIFI2.11(GPIO12)
N$75: LED7.C R21.2
N$76: LED8.C R30.2
N$77: WIFI1.14(NC1) WIFI2.NC1
N$78: WIFI1.15(NC2) WIFI2.NC2
N$79: WIFI1.16(NC3) WIFI2.NC3
N$80: WIFI1.17(3V3_REG_OUT) WIFI2.14(3V3_REG_OUT)
N$82: LED9.C R31.2
N$85: WIFI1.22(DMA-TX) WIFI2.19(DMA-TX)
N$86: WIFI1.23(DMA-RX) WIFI2.20(DMA-RX)
N$87: WIFI1.24(GPIO9) WIFI2.21(GPIO9)
N$88: WIFI1.25(GPIO8) WIFI2.22(GPIO8)
N$89: WIFI1.26(GPIO7) WIFI2.23(GPIO7)
N$90: WIFI1.27(GPIO6) WIFI2.24(GPIO6)
N$91: WIFI1.28(GPIO5) WIFI2.25(GPIO5)
N$92: WIFI1.29(GPIO4) WIFI2.26(GPIO4)
N$93: WIFI1.35(NC4) WIFI2.NC4
N$103: WIFI1.33(SENSE-PWR) WIFI2.30(SENSE-PWR)
P0.2 [signals]: WIFI1.12(UART_RX) WIFI2.12(UART_RX) ; also sheet 2
P0.3 [signals]: WIFI1.13(UART_TX) WIFI2.13(UART_TX) ; also sheet 2
P0.10 [signals]: BT1.13(UART_RX) BT2.P$21(UART_RX) ; also sheet 2
P0.11 [signals]: BT1.14(UART_TX) BT2.P$22(UART_TX) ; also sheet 2

### Notes on the sheet
- BlueTooth Module | WiFi Module

## Sheet 7 of 9
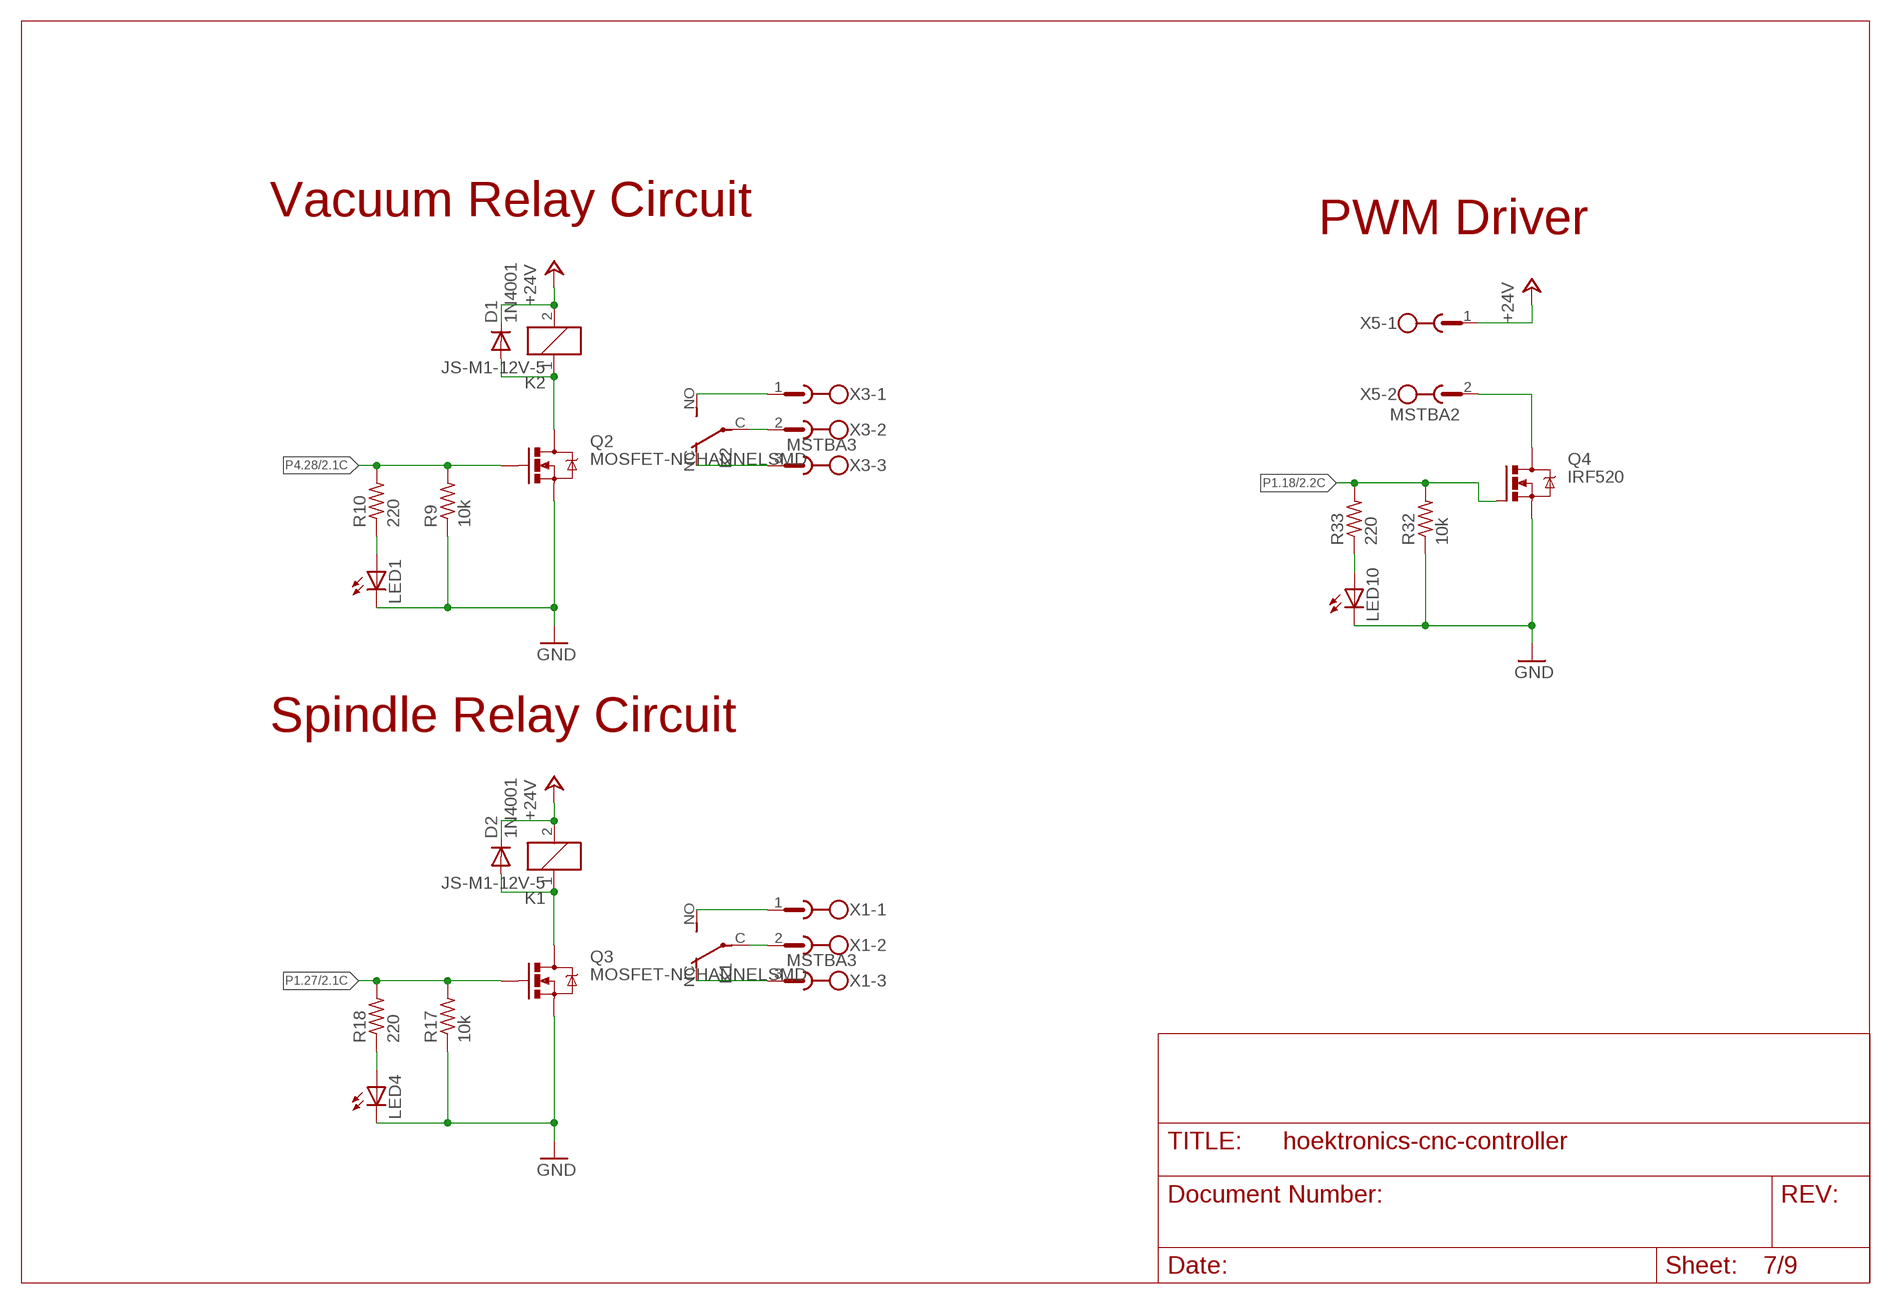
[diagram p6: schematic, sheet 7]

### Parts
D1  1N4001  DIODESMA  [SMA-DIODE]
D2  1N4001  DIODESMA  [SMA-DIODE]
K1  JS-M1-12V-5  [JS-M]
K2  JS-M1-12V-5  [JS-M]
LED1  LED1206  [LED-1206]
LED4  LED1206  [LED-1206]
LED10  LED1206  [LED-1206]
Q2  MOSFET-NCHANNELSMD  [SOT23-3]
Q3  MOSFET-NCHANNELSMD  [SOT23-3]
Q4  IRF520  [TO220BV]
R9  10k  R-US_R0805  [R0805]
R10  220  R-US_R0805  [R0805]
R17  10k  R-US_R0805  [R0805]
R18  220  R-US_R0805  [R0805]
R32  10k  R-US_R0805  [R0805]
R33  220  R-US_R0805  [R0805]
X1  MSTBA3  [MSTBA3]
X3  MSTBA3  [MSTBA3]
X5  MSTBA2  [MSTBA2]

### Nets
+24V [power]: D1.C D2.C K1.2 K2.2 X5.1 ; also sheet 3,4,5
GND: LED1.C LED4.C LED10.C Q2.2(S) Q3.2(S) Q4.S R9.1 R17.1 R32.1 ; also sheet 2,3,4,5,6,8,9
N$5: D1.A K2.1 Q2.3(D)
N$15 [highvolt]: K1.NO(2:S) X1.1
N$17 [signals]: LED1.A R10.1
N$18 [highvolt]: K2.NO(2:S) X3.1
N$19 [highvolt]: K2.C(2:P) X3.2
N$20 [highvolt]: K2.NC(2:O) X3.3
N$29 [highvolt]: K1.C(2:P) X1.2
N$30: D2.A K1.1 Q3.3(D)
N$35 [signals]: LED4.A R18.1
N$37 [highvolt]: K1.NC(2:O) X1.3
N$81: Q4.D X5.2
N$83 [signals]: LED10.A R33.1
P1.18: Q4.G R32.2 R33.2 ; also sheet 2
P1.27 [signals]: Q3.1(G) R17.2 R18.2 ; also sheet 2
P4.28 [signals]: Q2.1(G) R9.2 R10.2 ; also sheet 2

### Notes on the sheet
- Vacuum Relay Circuit
- PWM Driver
- Spindle Relay Circuit

## Sheet 8 of 9
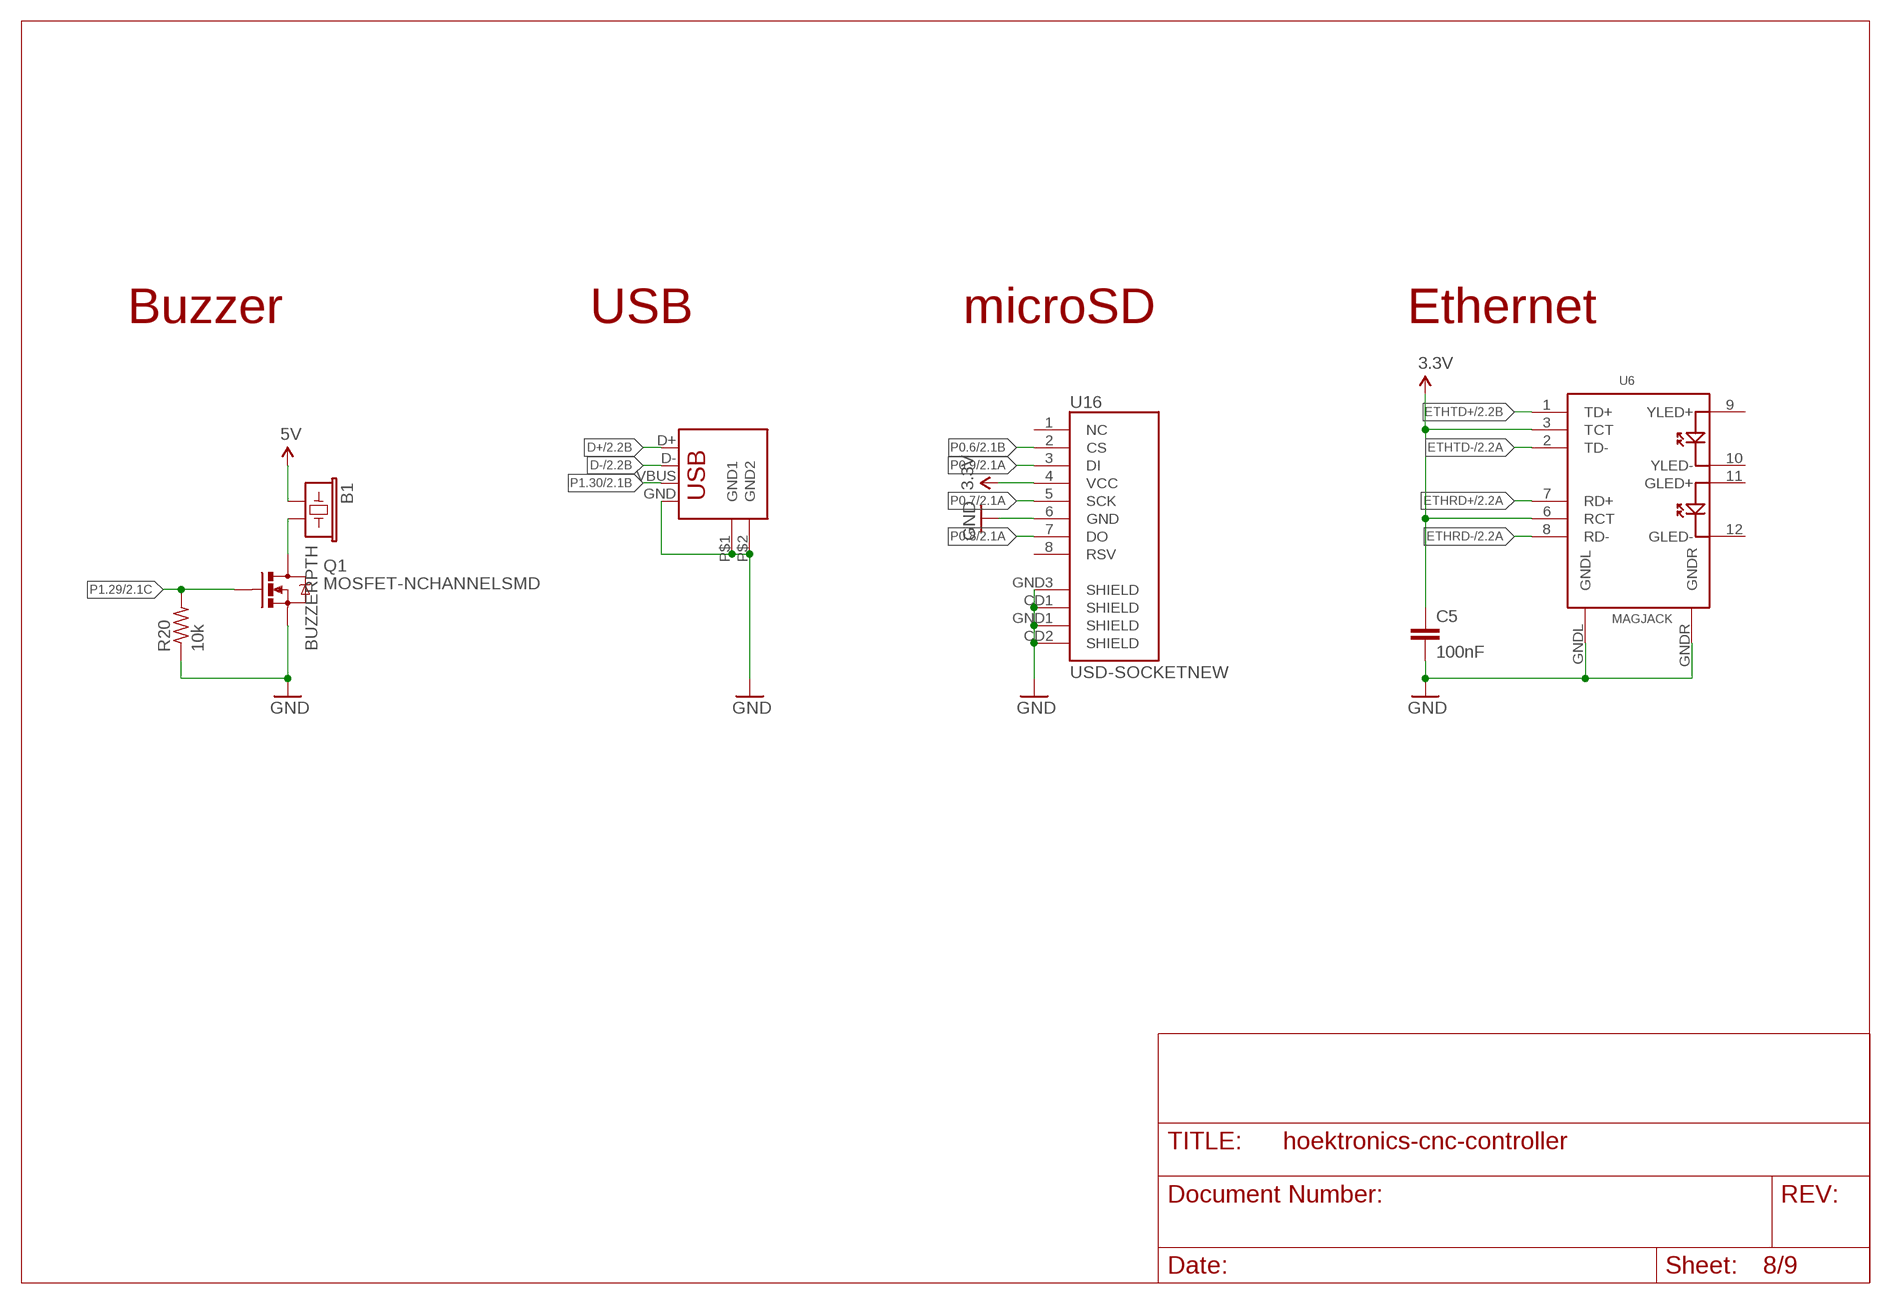
[diagram p7: schematic, sheet 8]

### Parts
B1  BUZZERPTH  [BUZZER-12MM]
C5  100nF  CAP0805  [0805]
Q1  MOSFET-NCHANNELSMD  [SOT23-3]
R20  10k  R-US_R0805  [R0805]
U6  MAGJACK  [MAGJACK]
U16  USD-SOCKETNEW  [MICRO-SD-SOCKET-PP]
X2  USBPTH  [USB-B-PTH]

### Nets
3.3V: C5.1 U6.3(TCT) U6.6(RCT) U16.4(VCC) ; also sheet 2,3,6,9
5V: B1.+ ; also sheet 2,3,4,5
D+ [signals]: X2.D+ ; also sheet 2
D- [signals]: X2.D- ; also sheet 2
ETHRD+ [signals]: U6.7(RD+) ; also sheet 2
ETHRD- [signals]: U6.8(RD-) ; also sheet 2
ETHTD+ [signals]: U6.1(TD+) ; also sheet 2
ETHTD- [signals]: U6.2(TD-) ; also sheet 2
GND: C5.2 Q1.2(S) R20.1 U6.GNDL U6.GNDR U16.6(GND) U16.CD1(SHIELD) U16.CD2(SHIELD) U16.GND1(SHIELD) U16.GND3(SHIELD) X2.GND X2.P$1(GND1) X2.P$2(GND2) ; also sheet 2,3,4,5,6,7,9
N$38 [signals]: B1.- Q1.3(D)
P0.6 [signals]: U16.2(CS) ; also sheet 2
P0.7 [signals]: U16.5(SCK) ; also sheet 2
P0.8 [signals]: U16.7(DO) ; also sheet 2
P0.9 [signals]: U16.3(DI) ; also sheet 2
P1.29 [signals]: Q1.1(G) R20.2 ; also sheet 2
P1.30 [signals]: X2.VBUS ; also sheet 2
Unconnected: U6.9(YLED+) U6.10(YLED-) U6.11(GLED+) U6.12(GLED-) U16.1(NC) U16.8(RSV)

### Notes on the sheet
- Buzzer | USB | microSD | Ethernet

## Sheet 9 of 9
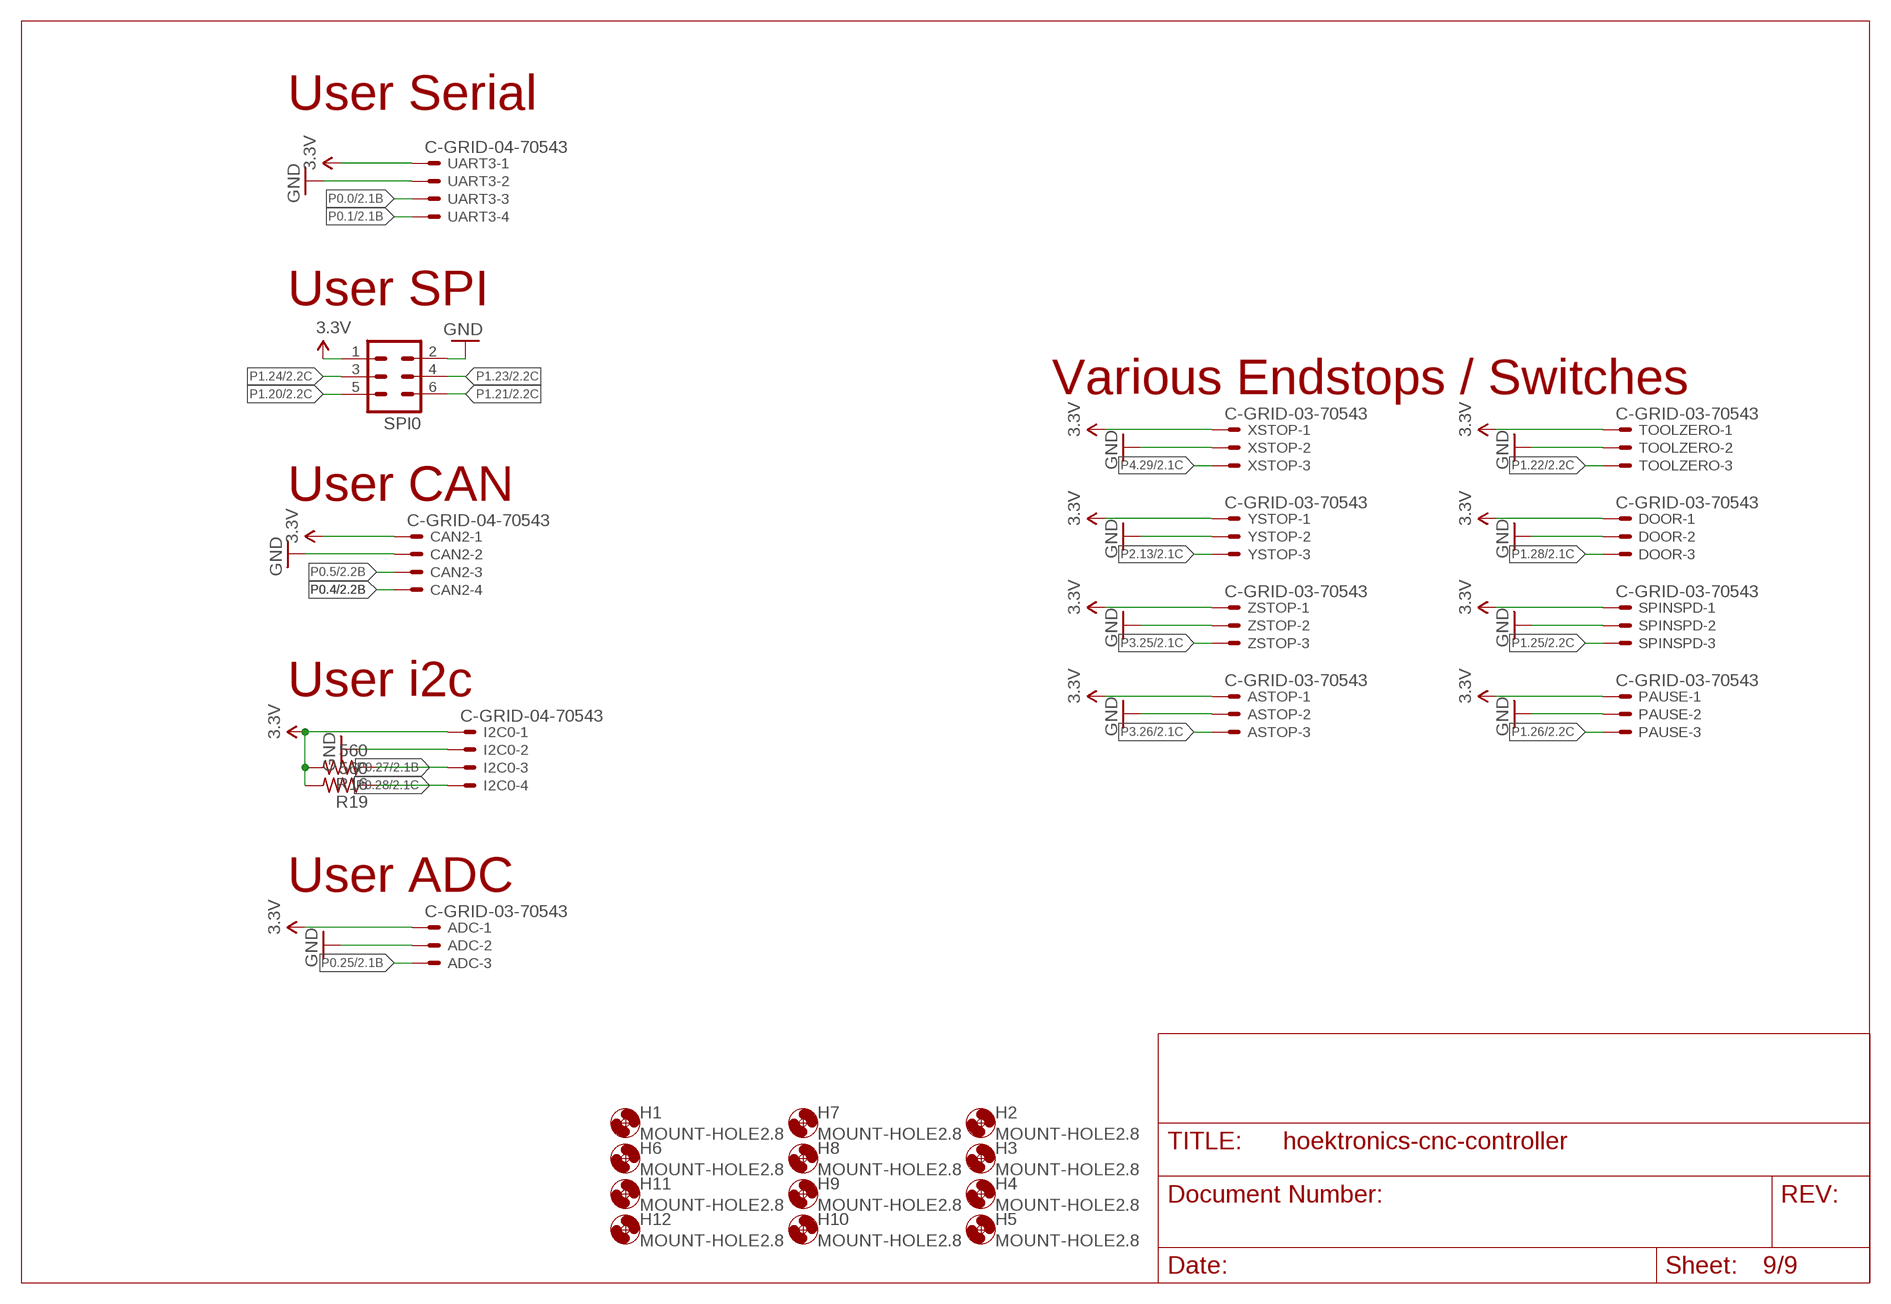
[diagram p8: schematic, sheet 9]

### Parts
ADC  C-GRID-03-70543  [70543-03]
ASTOP  C-GRID-03-70543  [70543-03]
CAN2  C-GRID-04-70543  [70543-04]
DOOR  C-GRID-03-70543  [70543-03]
H1  MOUNT-HOLE2.8  [2,8]
H2  MOUNT-HOLE2.8  [2,8]
H3  MOUNT-HOLE2.8  [2,8]
H4  MOUNT-HOLE2.8  [2,8]
H5  MOUNT-HOLE2.8  [2,8]
H6  MOUNT-HOLE2.8  [2,8]
H7  MOUNT-HOLE2.8  [2,8]
H8  MOUNT-HOLE2.8  [2,8]
H9  MOUNT-HOLE2.8  [2,8]
H10  MOUNT-HOLE2.8  [2,8]
H11  MOUNT-HOLE2.8  [2,8]
H12  MOUNT-HOLE2.8  [2,8]
I2C0  C-GRID-04-70543  [70543-04]
PAUSE  C-GRID-03-70543  [70543-03]
R16  560  R-US_R0805  [R0805]
R19  560  R-US_R0805  [R0805]
SPI0  ML6  [ML6]
SPINSPD  C-GRID-03-70543  [70543-03]
TOOLZERO  C-GRID-03-70543  [70543-03]
UART3  C-GRID-04-70543  [70543-04]
XSTOP  C-GRID-03-70543  [70543-03]
YSTOP  C-GRID-03-70543  [70543-03]
ZSTOP  C-GRID-03-70543  [70543-03]

### Nets
3.3V: ADC.1 ASTOP.1 CAN2.1 DOOR.1 I2C0.1 PAUSE.1 R16.2 R19.2 SPI0.1 SPINSPD.1 TOOLZERO.1 UART3.1 XSTOP.1 YSTOP.1 ZSTOP.1 ; also sheet 2,3,6,8
GND: ADC.2 ASTOP.2 CAN2.2 DOOR.2 I2C0.2 PAUSE.2 SPI0.2 SPINSPD.2 TOOLZERO.2 UART3.2 XSTOP.2 YSTOP.2 ZSTOP.2 ; also sheet 2,3,4,5,6,7,8
P0.0 [signals]: UART3.3 ; also sheet 2
P0.1 [signals]: UART3.4 ; also sheet 2
P0.4 [signals]: CAN2.4 ; also sheet 2
P0.5 [signals]: CAN2.3 ; also sheet 2
P0.25 [signals]: ADC.3 ; also sheet 2
P0.27 [signals]: I2C0.3 R16.1 ; also sheet 2
P0.28 [signals]: I2C0.4 R19.1 ; also sheet 2
P1.20 [signals]: SPI0.5 ; also sheet 2
P1.21: SPI0.6 ; also sheet 2
P1.22: TOOLZERO.3 ; also sheet 2
P1.23 [signals]: SPI0.4 ; also sheet 2
P1.24 [signals]: SPI0.3 ; also sheet 2
P1.25 [signals]: SPINSPD.3 ; also sheet 2
P1.26 [signals]: PAUSE.3 ; also sheet 2
P1.28 [signals]: DOOR.3 ; also sheet 2
P2.13 [signals]: YSTOP.3 ; also sheet 2
P3.25 [signals]: ZSTOP.3 ; also sheet 2
P3.26 [signals]: ASTOP.3 ; also sheet 2
P4.29 [signals]: XSTOP.3 ; also sheet 2

### Notes on the sheet
- User Serial
- User SPI
- Various Endstops / Switches
- User CAN
- User i2c
- User ADC

## Library data of the parts
A X Y Z = con-molex:KK-156-4: KK 156 HEADER Source: http://www.molex.com/pdm_docs/sd/026604100_sd.pdf; OC_FARNELL: unknown; OC_NEWARK: unknown
ADC ASTOP DOOR PAUSE SPINSPD TOOLZERO XSTOP YSTOP ZSTOP = con-molex:C-GRID-03: CONNECTOR wire to board 2.54 mm (0.100") pitch header; OC_FARNELL: unknown; OC_NEWARK: unknown
B1 = SparkFun:BUZZER: Buzzer 12mm Spark Fun Electronics SKU : Comp-Buzzer
BT1 BT2 = Hoektronics:RN-42
C1-C4 C6 C8 C10 = rcl:CPOL-US: POLARIZED CAPACITOR, American symbol
C5 C7 C9 C11 = SparkFun:CAP: Capacitor Standard 0603 ceramic capacitor, and 0.1" leaded capacitor.
CAN2 I2C0 UART3 = con-molex:C-GRID-04: CONNECTOR wire to board 2.54 mm (0.100") pitch header; OC_FARNELL: unknown; OC_NEWARK: unknown
D1 D2 = SparkFun:DIODE: Diode These are standard reverse protection diodes and small signal diodes. SMA package can handle up to about 1A. SOD-323 can handle about 200mA. What the SOD-323 package when ordering, there are some mfgs out there that are 5-pin packages.
D3 = diode:BYT85: DIODE
F1 = Hoektronics:FUSE: Littelfuse 01000020Z - 20A @
H1-H12 = holes:MOUNT-HOLE: MOUNTING HOLE with drill center marker
ISPBOOT RESET S1 = SparkFun:TAC_SWITCH: Momentary Switch Button commonly used for reset or general input. Spark Fun Electronics SKU : COM-00097
JP1 JP3 JP5 JP9 = pinhead:PINHD-2X2: PIN HEADER
JP2 JP4 JP6 JP10 = pinhead:PINHD-2X4: PIN HEADER
JP7 = SparkFun:M06: Header 6 Standard 6-pin 0.1" header. Use with straight break away headers (SKU : PRT-00116), right angle break away headers (PRT-00553), swiss pins (PRT-00743), machine pins (PRT-00117), and female headers (PRT-00115). Molex polarized connector foot print use with SKU : PRT-08094 with associated crimp pins and housings. NOTES ON THE VARIANTS LOCK and LOCK_LONGPADS... This footprint was designed to help hold the alignment of a through-hole component (i.e. 6-pin header) while soldering it into place. You may notice that each hole has been shifted either up or down by 0.005 of an inch from it's more standard position (which is a perfectly straight line). This slight alteration caused the pins (the squares in the middle) to touch the edges of the holes. Because they are alternating, it causes a "brace" to hold the component in place. 0.005 has proven to be the perfect amount of "off-center" position when using our standard breakaway headers. Although looks a little odd when you look at the bare footprint, once you have a header in there, the alteration is very hard to notice. Also, if you push a header all the way into place, it is covered up entirely on the bottom side. This idea of altering the position of holes to aid alignment will be further integrated into the Sparkfun Library for other footprints. It can help hold any component with 3 or more connection pins.
JP8 JP11-JP13 = Hoektronics:PINHD-2X3: PIN HEADER
K1 K2 = relay:JS-M1*: Automotive Ultra-Miniature Power Relay NAiS Source: http://www.mew-europe.com/.. en_ds_61211_0000.pdf
LED1-LED10 = SparkFun:LED: LEDs Standard schematic elements and footprints for 5mm, 3mm, 1206, and 0603 sized LEDs. 5mm - Spark Fun Electronics SKU : COM-00529 (and others)
LPC1 = LPCXpresso_boards:LPCXPRESSO_LPC1769
Q1-Q3 = SparkFun:MOSFET-NCHANNEL
Q4 = transistor-power:IRF520: HEXFET Power MOSFET
R1-R27 R29-R34 = resistor:R-US_: RESISTOR, American symbol
R28 = Hoektronics:WSL3637
SPI0 SV2 = con-harting-ml:ML6: HARTING; OC_FARNELL: unknown; OC_NEWARK: unknown
U1-U4 = Hoektronics:HOEKSTEP23
U5 U7 = Hoektronics:IXF25001
U6 = Hoektronics:MAGJACK
U8 U9 = MakerBot:SN74LVC4245A
U10-U13 = Hoektronics:HOEKSTEP17
U16 = SparkFun:USD-SOCKET: microSD Socket Push-push type uSD socket. Schematic element and footprint production proven. Spark Fun Electronics SKU : PRT-00127. tDoc lines correctly indicate media card edge positions when inserting (unlocked, locked, depressed).
WIFI1 WIFI2 = Hoektronics:RN-131
X1 X3 = con-phoenix-508:MSTBA3: PHOENIX; MF: FARNELL; MPN: 1757255; OC_FARNELL: 3705183; OC_NEWARK: 71C4162
X2 = Hoektronics:USB: USB Connectors USB-B-PTH is fully proven SKU : PRT-00139 USB-miniB is fully proven SKU : PRT-00587 USB-A-PCB is untested. USB-A-H is throughly reviewed, but untested. Spark Fun Electronics SKU : PRT-00437 USB-B-SMT is throughly reviewed, but untested. Needs silkscreen touching up. USB-A-S has not been used/tested USB-MB-H has not been used/tested
X4 = con-phoenix-762:GMSTBA2: PHOENIX; MF: FARNELL; MPN: 1757242; OC_FARNELL: 3705171; OC_NEWARK: 71C4161
X5 = con-phoenix-508:MSTBA2: PHOENIX; MF: FARNELL; MPN: 1757242; OC_FARNELL: 3705171; OC_NEWARK: 71C4161

## Net classes
0 default: width 0.406 mm, clearance 0.381 mm
1 power: width 1.524 mm, clearance 0.635 mm
2 highvolt: width 1.778 mm, clearance 3.175 mm
3 signals: width 0.254 mm, clearance 0.318 mm